# EAGLE design schody.v2 (EAGLE 9.4.0)
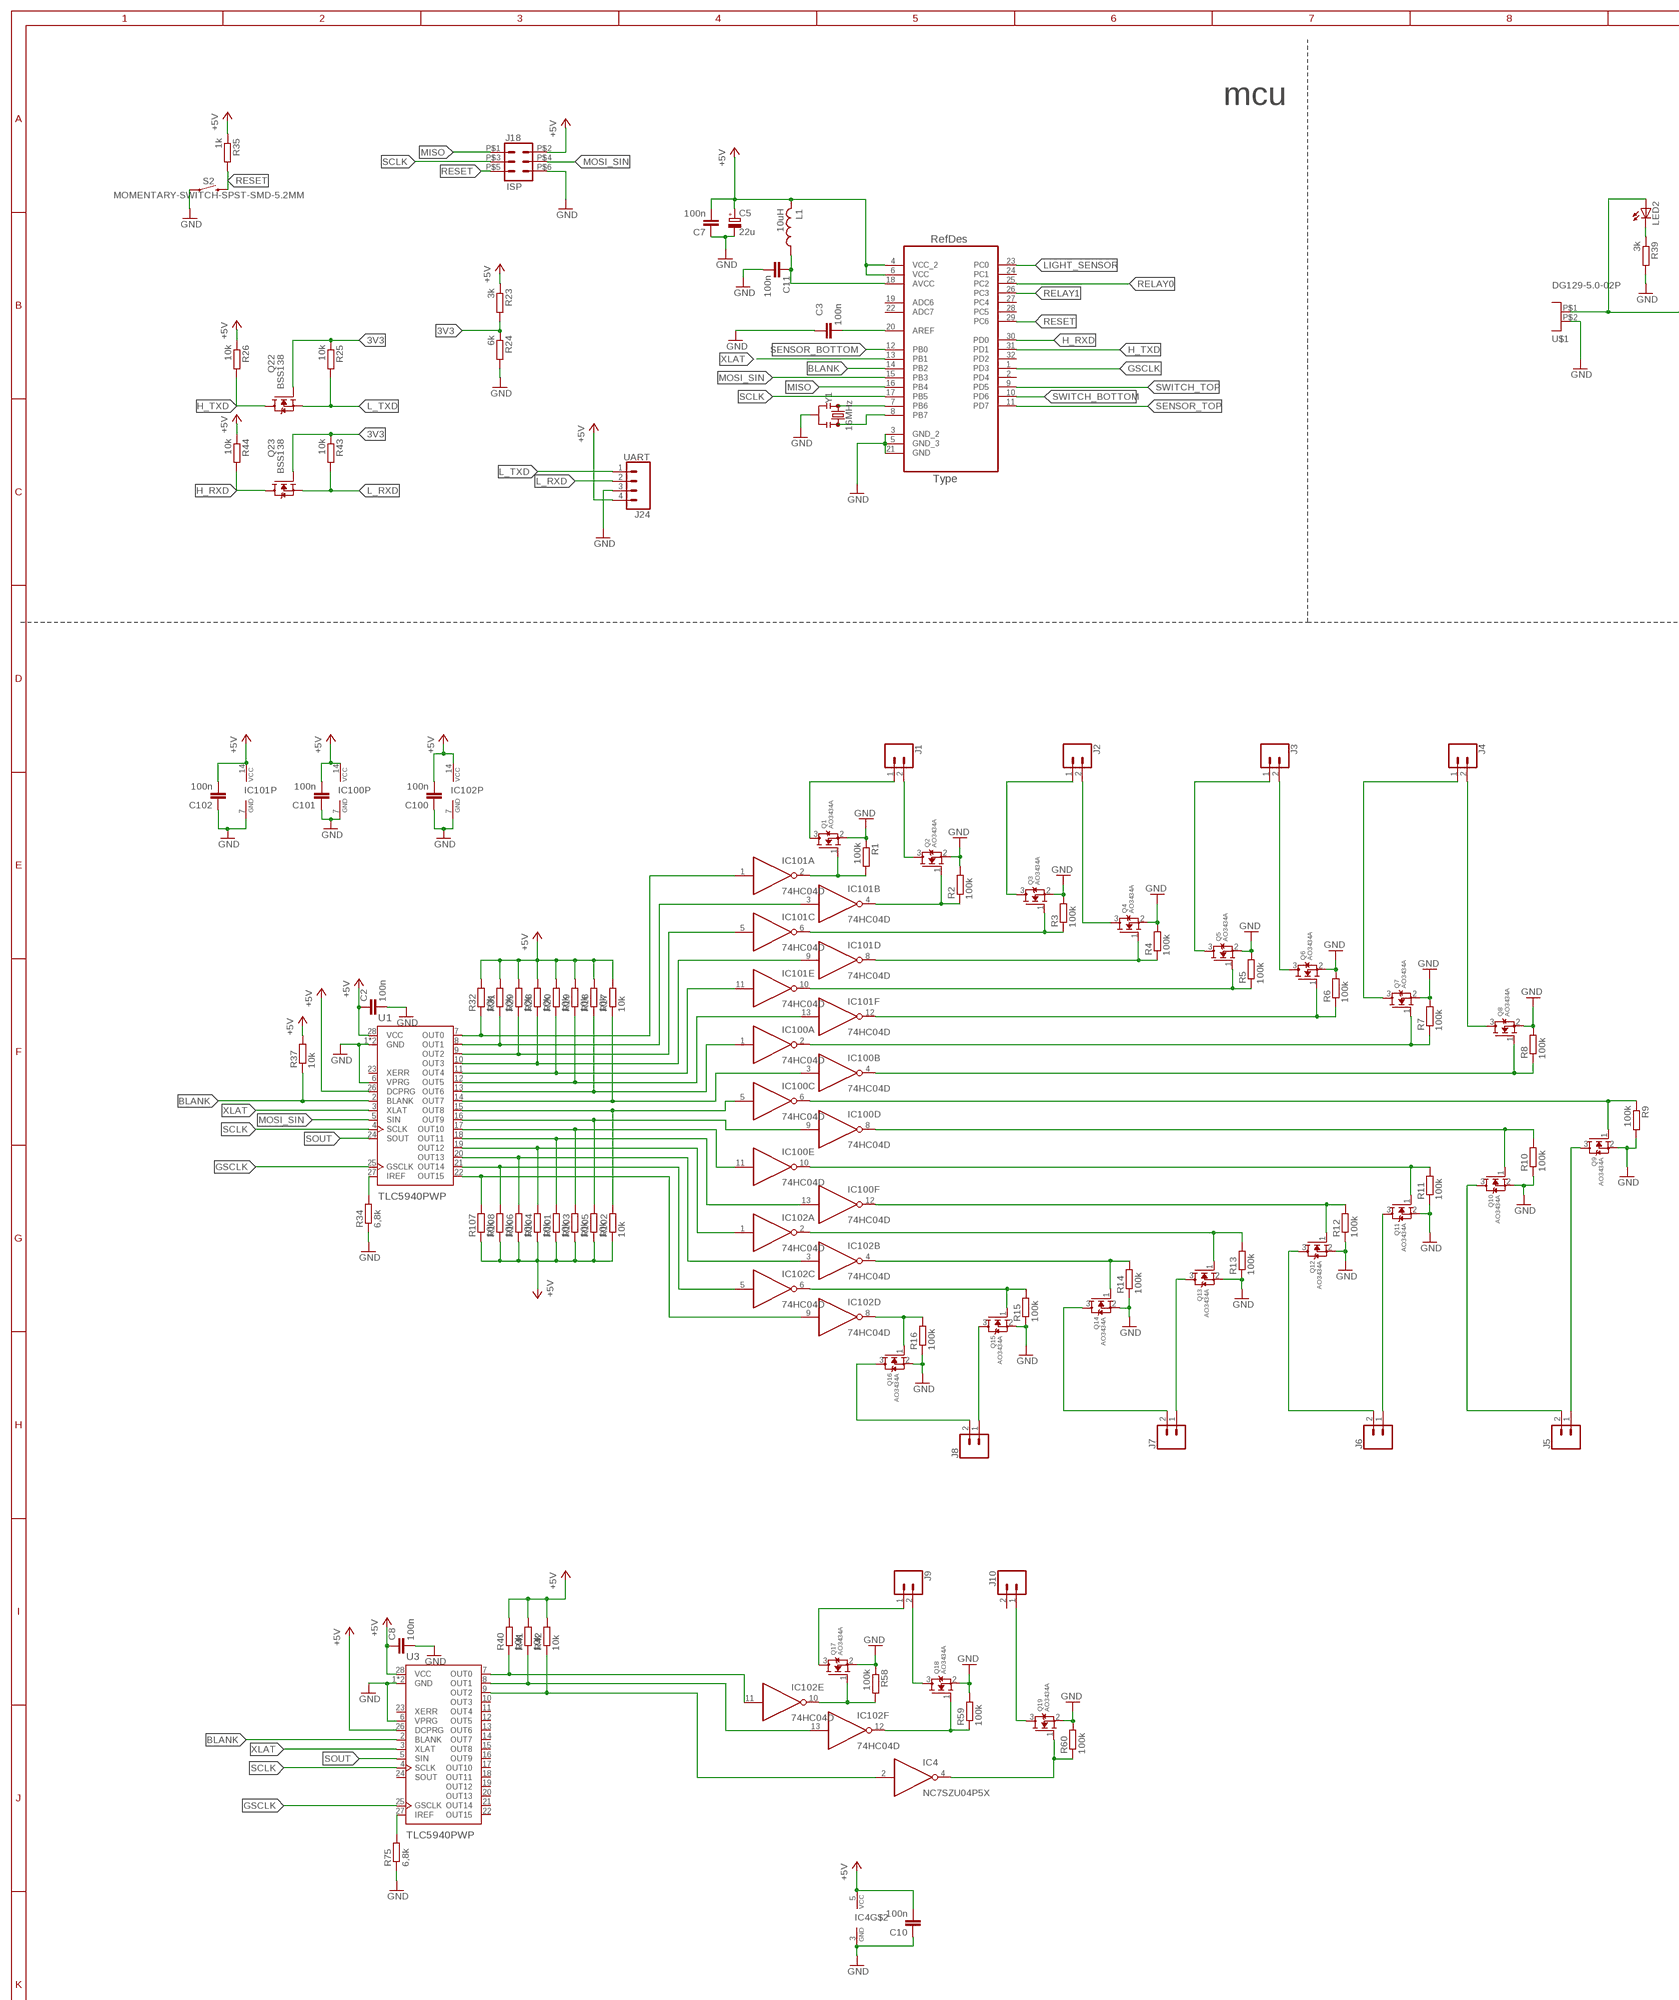
[diagram p0: schematic, sheet 1, part 1 of 3]
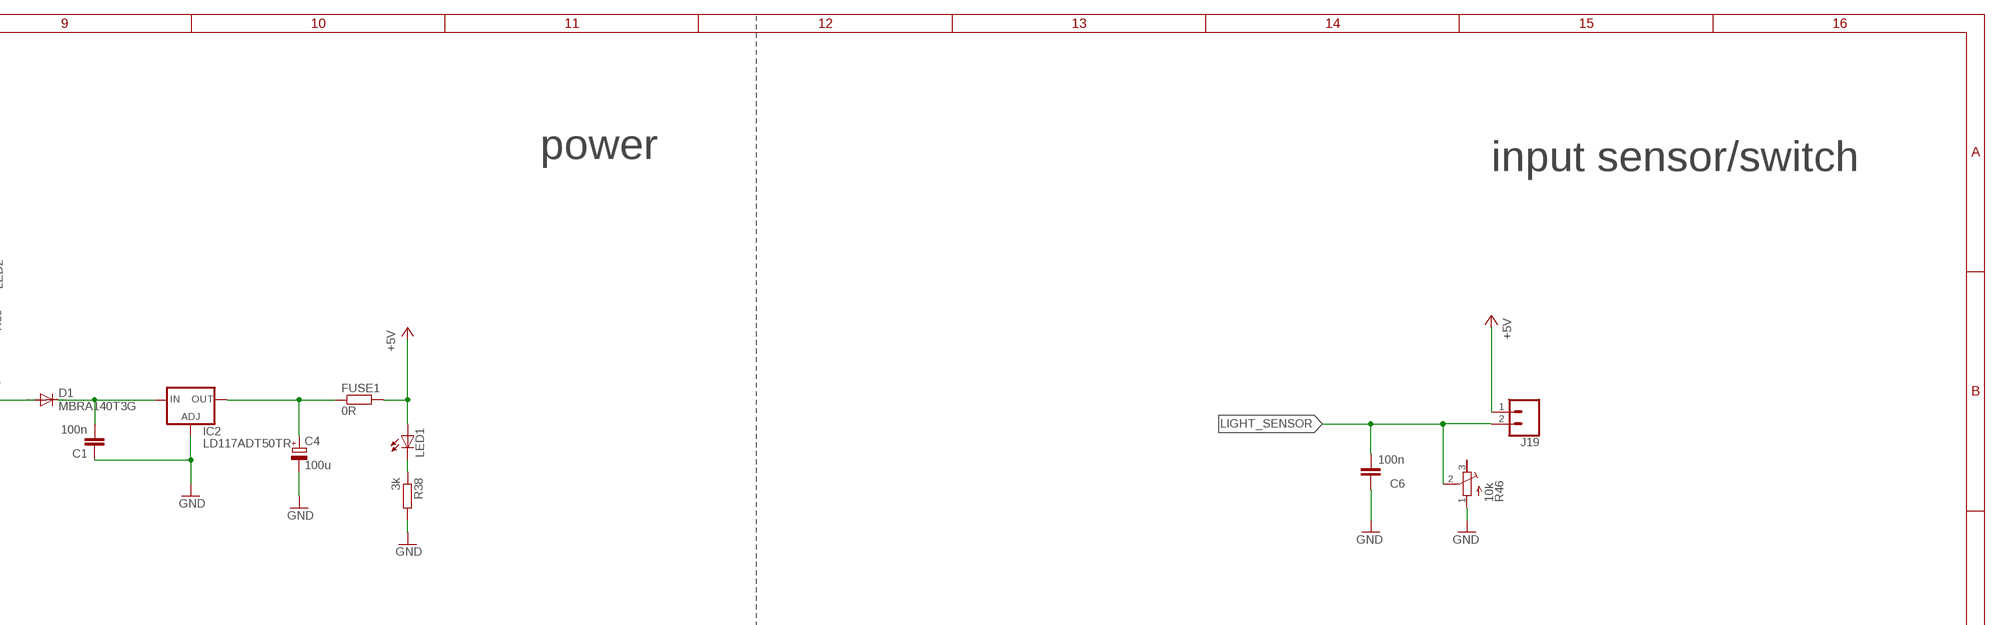
[diagram p1: schematic, sheet 1, part 2 of 3]
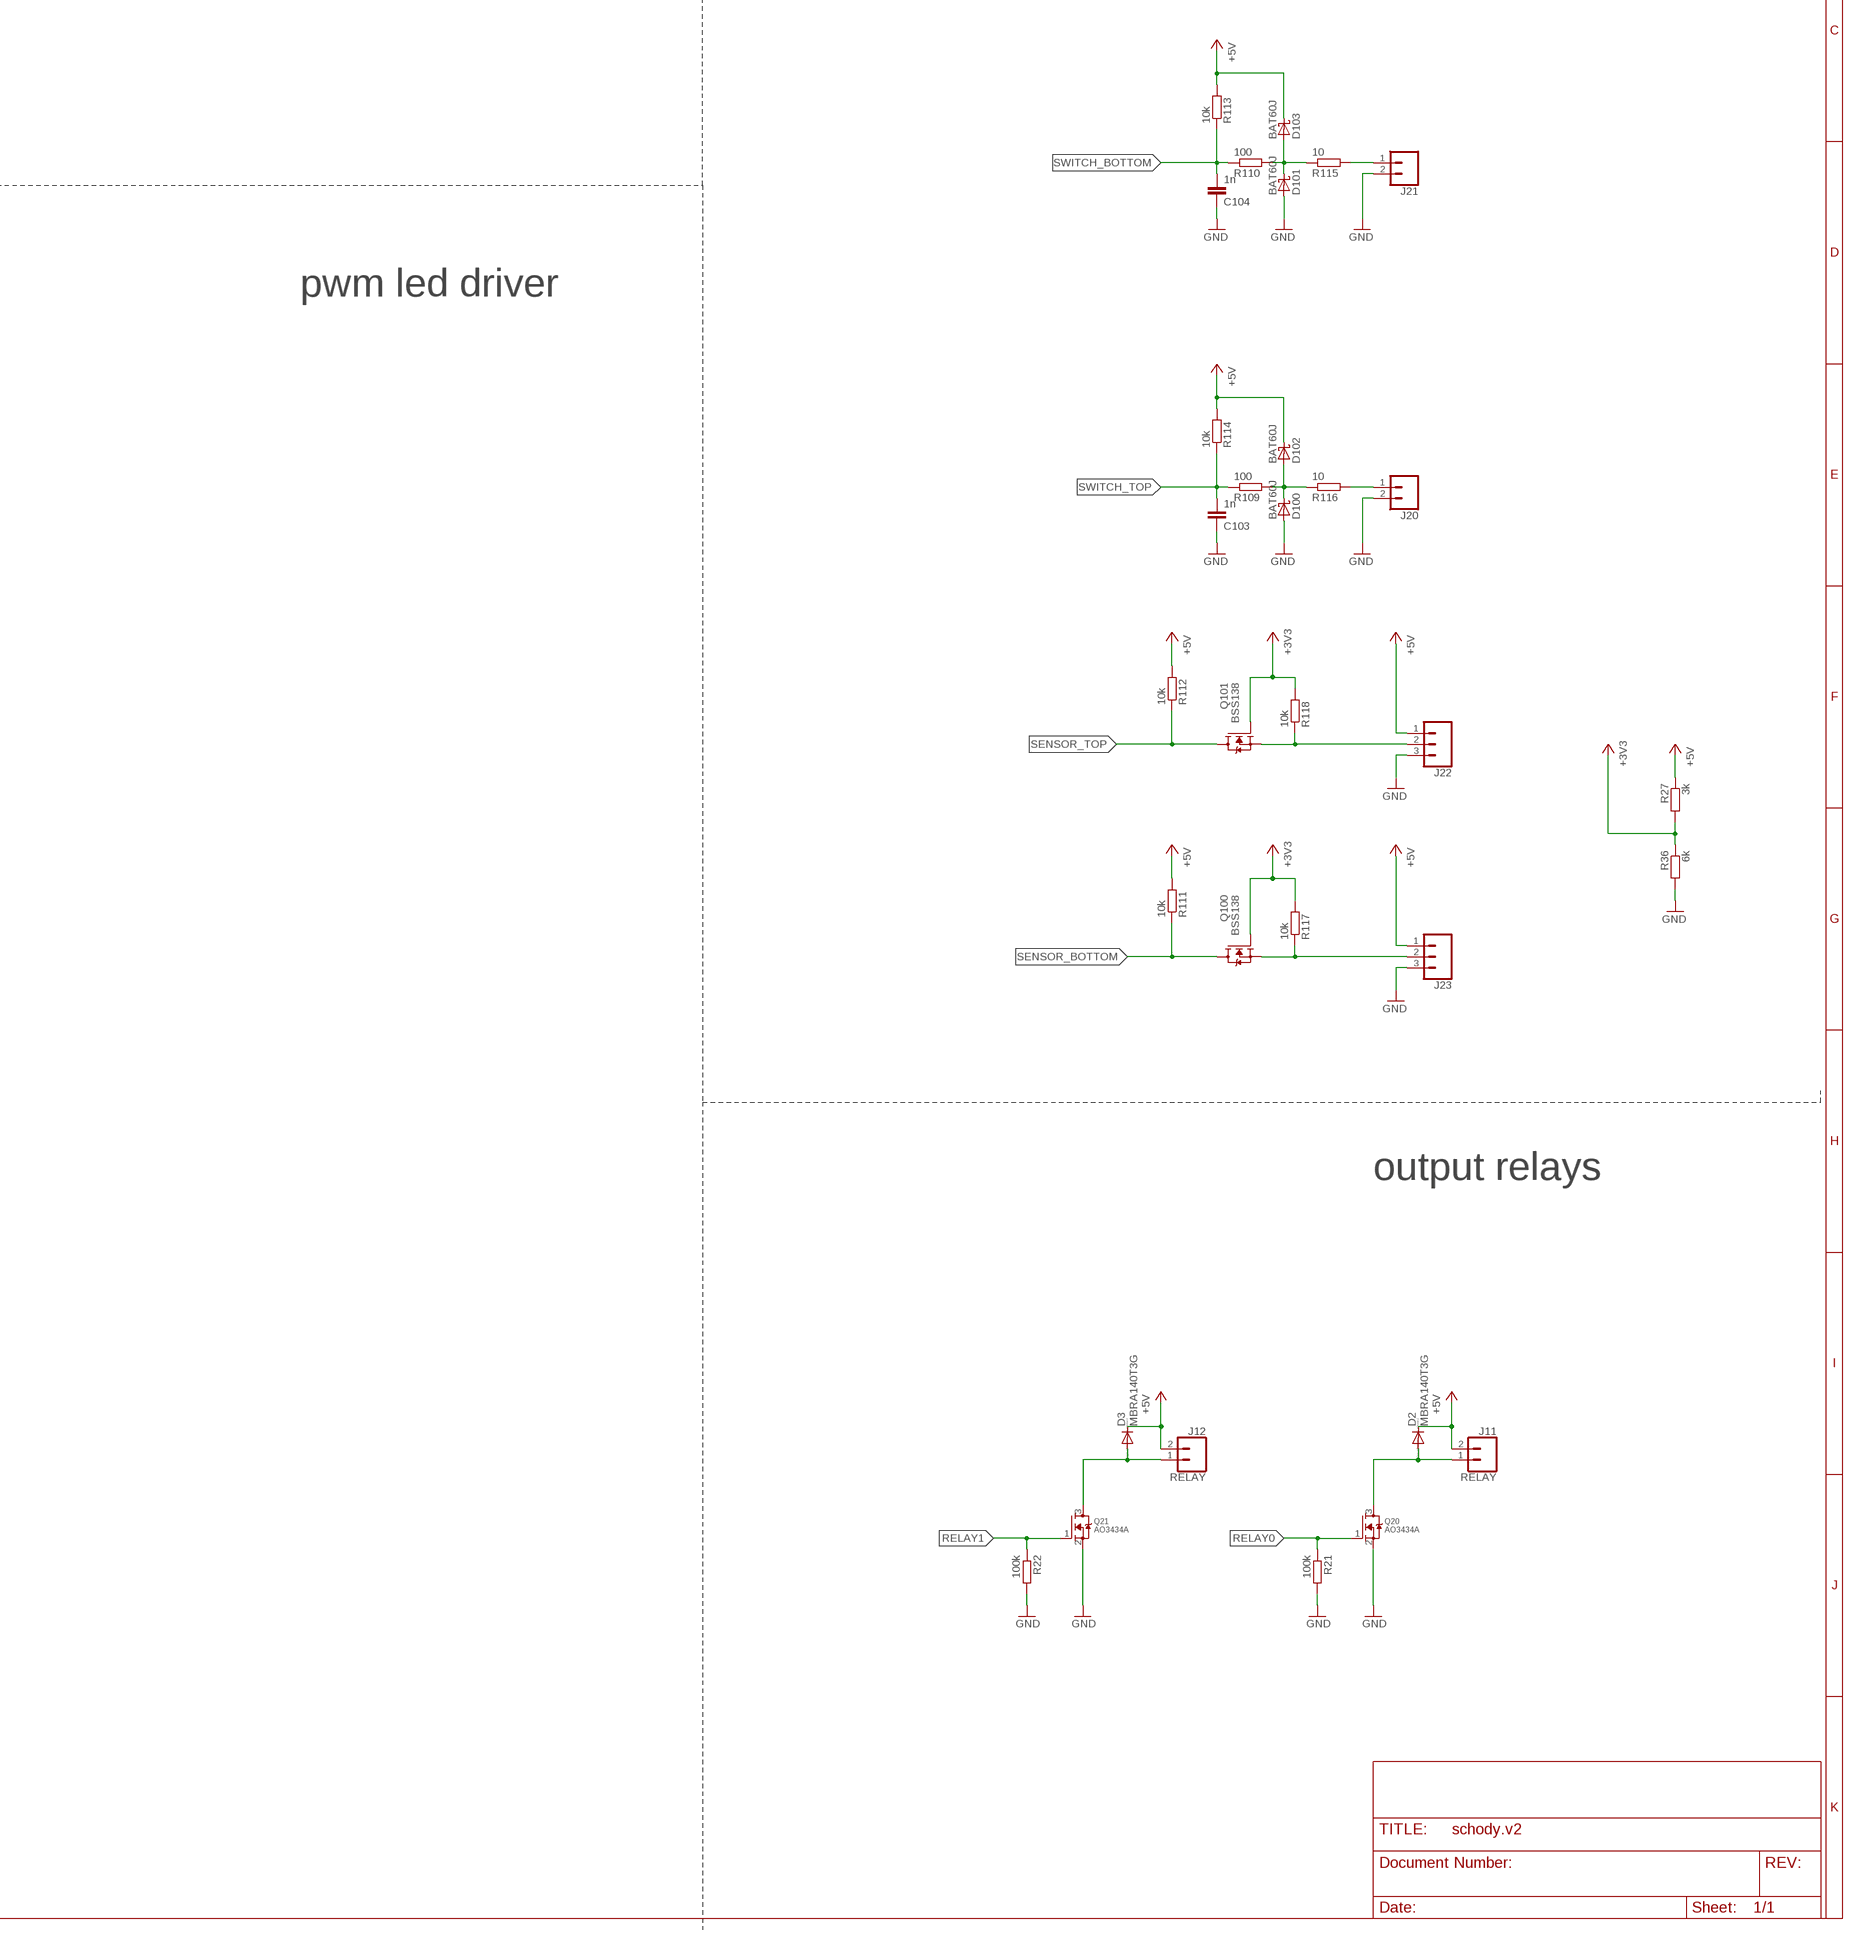
[diagram p2: schematic, sheet 1, part 3 of 3]

## Parts
C1  100n  C-EUC0805K  [C0805K]
C2  100n  C-EUC0805K  [C0805K]
C3  100n  C-EUC0805  [C0805]
C4  100u  CPOL-EUSMCD  [SMC_D]
C5  22u  CPOL-EUSMCE  [SMC_E]
C6  100n  C-EUC0805  [C0805]
C7  100n  C-EUC0805  [C0805]
C8  100n  C-EUC0805K  [C0805K]
C10  100n  C-EUC0805K  [C0805K]
C11  100n  C-EUC0805  [C0805]
C100  100n  C-EUC0805K  [C0805K]
C101  100n  C-EUC0805K  [C0805K]
C102  100n  C-EUC0805K  [C0805K]
C103  1n  C-EUC0805K  [C0805K]
C104  1n  C-EUC0805K  [C0805K]
D1  MBRA140T3G  DIODE-DO214BA  [DO214BA]
D2  MBRA140T3G  DIODE-DO214BA  [DO214BA]
D3  MBRA140T3G  DIODE-DO214BA  [DO214BA]
D100  BAT60J  [SOD323_ST]
D101  BAT60J  [SOD323_ST]
D102  BAT60J  [SOD323_ST]
D103  BAT60J  [SOD323_ST]
FUSE1  0R  R-EU_M1206  [M1206]
IC2  LD117ADT50TR  [DPACK]
IC4  NC7SZU04P5X  74AHC1GU04DCK  [SC70-5]
IC100  74HC04D  [SO14]
IC101  74HC04D  [SO14]
IC102  74HC04D  [SO14]
J1  CONN_023.5MM  [SCREWTERMINAL-3.5MM-2]
J2  CONN_023.5MM  [SCREWTERMINAL-3.5MM-2]
J3  CONN_023.5MM  [SCREWTERMINAL-3.5MM-2]
J4  CONN_023.5MM  [SCREWTERMINAL-3.5MM-2]
J5  CONN_023.5MM  [SCREWTERMINAL-3.5MM-2]
J6  CONN_023.5MM  [SCREWTERMINAL-3.5MM-2]
J7  CONN_023.5MM  [SCREWTERMINAL-3.5MM-2]
J8  CONN_023.5MM  [SCREWTERMINAL-3.5MM-2]
J9  CONN_023.5MM  [SCREWTERMINAL-3.5MM-2]
J10  CONN_023.5MM  [SCREWTERMINAL-3.5MM-2]
J11  RELAY  CONN_023.5MM  [SCREWTERMINAL-3.5MM-2]
J12  RELAY  CONN_023.5MM  [SCREWTERMINAL-3.5MM-2]
J18  ISP  CONN_03X2POGO_PINS  [2X3_POGO]
J19  CONN_023.5MM  [SCREWTERMINAL-3.5MM-2]
J20  CONN_023.5MM  [SCREWTERMINAL-3.5MM-2]
J21  CONN_023.5MM  [SCREWTERMINAL-3.5MM-2]
J22  CONN_03SCREW  [SCREWTERMINAL-3.5MM-3]
J23  CONN_03SCREW  [SCREWTERMINAL-3.5MM-3]
J24  UART  CONN_04  [1X04]
L1  10uH  L_USB  [0805]
LED1  LEDCHIP-LED0805  [CHIP-LED0805]
LED2  LEDCHIP-LED0805  [CHIP-LED0805]
Q1  AO3434A  MOSFET-NWAVE  [SOT23-W]
Q2  AO3434A  MOSFET-NWAVE  [SOT23-W]
Q3  AO3434A  MOSFET-NWAVE  [SOT23-W]
Q4  AO3434A  MOSFET-NWAVE  [SOT23-W]
Q5  AO3434A  MOSFET-NWAVE  [SOT23-W]
Q6  AO3434A  MOSFET-NWAVE  [SOT23-W]
Q7  AO3434A  MOSFET-NWAVE  [SOT23-W]
Q8  AO3434A  MOSFET-NWAVE  [SOT23-W]
Q9  AO3434A  MOSFET-NWAVE  [SOT23-W]
Q10  AO3434A  MOSFET-NWAVE  [SOT23-W]
Q11  AO3434A  MOSFET-NWAVE  [SOT23-W]
Q12  AO3434A  MOSFET-NWAVE  [SOT23-W]
Q13  AO3434A  MOSFET-NWAVE  [SOT23-W]
Q14  AO3434A  MOSFET-NWAVE  [SOT23-W]
Q15  AO3434A  MOSFET-NWAVE  [SOT23-W]
Q16  AO3434A  MOSFET-NWAVE  [SOT23-W]
Q17  AO3434A  MOSFET-NWAVE  [SOT23-W]
Q18  AO3434A  MOSFET-NWAVE  [SOT23-W]
Q19  AO3434A  MOSFET-NWAVE  [SOT23-W]
Q20  AO3434A  MOSFET-NWAVE  [SOT23-W]
Q21  AO3434A  MOSFET-NWAVE  [SOT23-W]
Q22  BSS138  [SOT23]
Q23  BSS138  [SOT23]
Q100  BSS138  [SOT23]
Q101  BSS138  [SOT23]
R1  100k  R-EU_M0805  [M0805]
R2  100k  R-EU_M0805  [M0805]
R3  100k  R-EU_M0805  [M0805]
R4  100k  R-EU_M0805  [M0805]
R5  100k  R-EU_M0805  [M0805]
R6  100k  R-EU_M0805  [M0805]
R7  100k  R-EU_M0805  [M0805]
R8  100k  R-EU_M0805  [M0805]
R9  100k  R-EU_M0805  [M0805]
R10  100k  R-EU_M0805  [M0805]
R11  100k  R-EU_M0805  [M0805]
R12  100k  R-EU_M0805  [M0805]
R13  100k  R-EU_M0805  [M0805]
R14  100k  R-EU_M0805  [M0805]
R15  100k  R-EU_M0805  [M0805]
R16  100k  R-EU_M0805  [M0805]
R17  10k  R-EU_M0805  [M0805]
R18  10k  R-EU_M0805  [M0805]
R19  10k  R-EU_M0805  [M0805]
R20  10k  R-EU_M0805  [M0805]
R21  100k  R-EU_M0805  [M0805]
R22  100k  R-EU_M0805  [M0805]
R23  3k  R-EU_M0805  [M0805]
R24  6k  R-EU_M0805  [M0805]
R25  10k  R-EU_M0805  [M0805]
R26  10k  R-EU_M0805  [M0805]
R27  3k  R-EU_M0805  [M0805]
R28  10k  R-EU_M0805  [M0805]
R29  10k  R-EU_M0805  [M0805]
R31  10k  R-EU_M0805  [M0805]
R32  10k  R-EU_M0805  [M0805]
R34  6,8k  R-EU_M0805  [M0805]
R35  1k  R-EU_M0805  [M0805]
R36  6k  R-EU_M0805  [M0805]
R37  10k  R-EU_M0805  [M0805]
R38  3k  R-EU_M0805  [M0805]
R39  3k  R-EU_M0805  [M0805]
R40  10k  R-EU_M0805  [M0805]
R41  10k  R-EU_M0805  [M0805]
R42  10k  R-EU_M0805  [M0805]
R43  10k  R-EU_M0805  [M0805]
R44  10k  R-EU_M0805  [M0805]
R46  10k  R-TRIMM64W  [RTRIM64W]
R58  100k  R-EU_M0805  [M0805]
R59  100k  R-EU_M0805  [M0805]
R60  100k  R-EU_M0805  [M0805]
R75  6,8k  R-EU_M0805  [M0805]
R101  10k  R-EU_M0805  [M0805]
R102  10k  R-EU_M0805  [M0805]
R103  10k  R-EU_M0805  [M0805]
R104  10k  R-EU_M0805  [M0805]
R105  10k  R-EU_M0805  [M0805]
R106  10k  R-EU_M0805  [M0805]
R107  10k  R-EU_M0805  [M0805]
R108  10k  R-EU_M0805  [M0805]
R109  100  R-EU_M0805  [M0805]
R110  100  R-EU_M0805  [M0805]
R111  10k  R-EU_M0805  [M0805]
R112  10k  R-EU_M0805  [M0805]
R113  10k  R-EU_M0805  [M0805]
R114  10k  R-EU_M0805  [M0805]
R115  10  R-EU_M0805  [M0805]
R116  10  R-EU_M0805  [M0805]
R117  10k  R-EU_M0805  [M0805]
R118  10k  R-EU_M0805  [M0805]
S2  MOMENTARY-SWITCH-SPST-SMD-5.2MM  [TACTILE_SWITCH_SMD_5.2MM]
U1  TLC5940PWP  [HTSSOP28PWP]
U2  ATMEGA328P-AU  [QFP80P900X900X120-32N]
U3  TLC5940PWP  [HTSSOP28PWP]
U$1  DG129-5.0-02P  [DG129-5.0-02P]
Y1  16MHz  RESONATOR-16MHZSMD_3.2X1.3  [RESONATOR-SMD-3.2X1.3]

## Nets
3V3: Q22.1(G) Q23.1(G) R23.2 R24.1 R25.1 R43.1
+3V33: Q100.1(G) Q101.1(G) R27.2 R36.1 R117.2 R118.2 ; supply symbol labelled +3V3
+5V: C2.1 C5.+ C7.2 C8.1 C10.2 C100.2 C101.2 C102.2 D2.C D3.C D102.C D103.C FUSE1.2 IC4.5(VCC) IC100.14(P:VCC) IC101.14(P:VCC) IC102.14(P:VCC) J11.2 J12.2 J18.P$2 J19.1 J22.1 J23.1 J24.4 L1.2 LED1.A R17.2 R18.2 R19.2 R20.2 R23.1 R26.1 R27.1 R28.2 R29.2 R31.2 R32.2 R35.1 R37.2 R40.2 R41.2 R42.2 R44.1 R101.1 R102.1 R103.1 R104.1 R105.1 R106.1 R107.1 R108.1 R111.2 R112.2 R113.2 R114.2 U1.26(DCPRG) U1.28(VCC) U2.4(VCC_2) U2.6(VCC) U3.26(DCPRG) U3.28(VCC)
BLANK: R37.1 U1.2(BLANK) U2.14(PB2) U3.2(BLANK)
GND: C1.1 C2.2 C3.1 C4.- C5.- C6.1 C7.1 C8.2 C10.1 C11.2 C100.1 C101.1 C102.1 C103.1 C104.1 D100.A D101.A IC2.1(ADJ) IC4.3(GND) IC100.7(P:GND) IC101.7(P:GND) IC102.7(P:GND) J18.P$6 J20.2 J21.2 J22.3 J23.3 J24.3 Q1.2(S) Q2.2(S) Q3.2(S) Q4.2(S) Q5.2(S) Q6.2(S) Q7.2(S) Q8.2(S) Q9.2(S) Q10.2(S) Q11.2(S) Q12.2(S) Q13.2(S) Q14.2(S) Q15.2(S) Q16.2(S) Q17.2(S) Q18.2(S) Q19.2(S) Q20.2(S) Q21.2(S) R1.1 R2.2 R3.2 R4.2 R5.2 R6.2 R7.2 R8.2 R9.2 R10.1 R11.1 R12.1 R13.1 R14.1 R15.1 R16.1 R21.2 R22.2 R24.2 R34.1 R36.2 R38.2 R39.2 R46.1(A) R58.1 R59.2 R60.2 R75.1 S2.1 U1.1(GND) U1.6(VPRG) U1.EXP(GND) U2.3(GND_2) U2.5(GND_3) U2.21(GND) U3.1(GND) U3.6(VPRG) U3.EXP(GND) U$1.P$2 Y1.2
GSCLK: U1.25(GSCLK) U2.1(PD3) U3.25(GSCLK)
H_RXD: Q23.3(D) R44.2 U2.30(PD0)
H_TXD: Q22.3(D) R26.2 U2.31(PD1)
L_RXD: J24.2 Q23.2(S) R43.2
L_TXD: J24.1 Q22.2(S) R25.2
LIGHT_SENSOR: C6.2 J19.2 R46.2(S) U2.23(PC0)
MISO: J18.P$1 U2.16(PB4)
MOSI_SIN: J18.P$4 U1.5(SIN) U2.15(PB3)
N$1: IC101.1(A:I) R32.1 U1.7(OUT0)
N$2: IC101.3(B:I) R31.1 U1.8(OUT1)
N$3: IC101.5(C:I) R29.1 U1.9(OUT2)
N$4: IC101.9(D:I) R28.1 U1.10(OUT3)
N$5: IC101.11(E:I) R20.1 U1.11(OUT4)
N$6: IC101.13(F:I) R19.1 U1.12(OUT5)
N$7: IC100.1(A:I) R18.1 U1.13(OUT6)
N$8: IC100.3(B:I) R17.1 U1.14(OUT7)
N$9: IC102.9(D:I) R107.2 U1.22(OUT15)
N$10: IC101.2(A:O) Q1.1(G) R1.2
N$11: IC102.3(B:I) R106.2 U1.20(OUT13)
N$12: IC102.1(A:I) R104.2 U1.19(OUT12)
N$13: IC100.13(F:I) R101.2 U1.18(OUT11)
N$14: IC100.11(E:I) R103.2 U1.17(OUT10)
N$15: IC100.9(D:I) R105.2 U1.16(OUT9)
N$16: IC100.5(C:I) R102.2 U1.15(OUT8)
N$17: IC102.5(C:I) R108.2 U1.21(OUT14)
N$18: J4.2 Q8.3(D)
N$19: IC101.6(C:O) Q3.1(G) R3.1
N$20: J2.2 Q4.3(D)
N$21: IC100.4(B:O) Q8.1(G) R8.1
N$22: J2.1 Q3.3(D)
N$23: IC101.8(D:O) Q4.1(G) R4.1
N$24: IC102.8(D:O) Q16.1(G) R16.2
N$25: J8.2 Q16.3(D)
N$26: J1.1 Q1.3(D)
N$27: IC101.10(E:O) Q5.1(G) R5.1
N$28: J3.1 Q5.3(D)
N$29: J9.2 Q18.3(D)
N$30: IC101.12(F:O) Q6.1(G) R6.1
N$31: J5.2 Q10.3(D)
N$32: J3.2 Q6.3(D)
N$33: IC102.6(C:O) Q15.1(G) R15.2
N$34: J1.2 Q2.3(D)
N$35: J6.1 Q11.3(D)
N$36: IC102.4(B:O) Q14.1(G) R14.2
N$37: J7.2 Q14.3(D)
N$38: IC100.8(D:O) Q10.1(G) R10.2
N$39: IC102.2(A:O) Q13.1(G) R13.2
N$40: IC100.6(C:O) Q9.1(G) R9.1
N$41: J7.1 Q13.3(D)
N$42: J20.1 R116.2
N$43: IC100.12(F:O) Q12.1(G) R12.2
N$44: J6.2 Q12.3(D)
N$45: J5.1 Q9.3(D)
N$46: IC100.10(E:O) Q11.1(G) R11.2
N$47: J8.1 Q15.3(D)
N$48: J21.1 R115.2
N$51: C1.2 D1.C IC2.3(IN)
N$53: U2.7(PB6) Y1.1
N$54: U2.8(PB7) Y1.3
N$55: R34.2 U1.27(IREF)
N$56: LED1.C R38.1
N$57: D101.C D103.A R110.2 R115.1
N$58: LED2.C R39.1
N$59: D100.C D102.A R109.2 R116.1
N$60: IC102.13(F:I) R41.1 U3.8(OUT1)
N$61: D2.A J11.1 Q20.3(D)
N$62: IC4.2(I) R42.1 U3.9(OUT2)
N$63: J22.2 Q101.2(S) R118.1
N$64: J23.2 Q100.2(S) R117.1
N$65: C11.1 L1.1 U2.18(AVCC)
N$66: C4.+ FUSE1.1 IC2.4(OUT)
N$67: C3.2 U2.20(AREF)
N$68: IC102.11(E:I) R40.1 U3.7(OUT0)
N$70: IC101.4(B:O) Q2.1(G) R2.1
N$71: IC100.2(A:O) Q7.1(G) R7.1
N$72: D1.A LED2.A U$1.P$1
N$73: J4.1 Q7.3(D)
N$74: D3.A J12.1 Q21.3(D)
N$75: IC4.4(O) Q19.1(G) R60.1
N$84: R75.2 U3.27(IREF)
N$85: IC102.10(E:O) Q17.1(G) R58.2
N$86: IC102.12(F:O) Q18.1(G) R59.1
N$88: J10.1 Q19.3(D)
N$116: J9.1 Q17.3(D)
RELAY0: Q20.1(G) R21.1 U2.25(PC2)
RELAY1: Q21.1(G) R22.1 U2.26(PC3)
RESET: J18.P$5 R35.2 S2.3 U2.29(PC6)
SCLK: J18.P$3 U1.4(SCLK) U2.17(PB5) U3.4(SCLK)
SENSOR_BOTTOM: Q100.3(D) R111.1 U2.12(PB0)
SENSOR_TOP: Q101.3(D) R112.1 U2.11(PD7)
SOUT: U1.24(SOUT) U3.5(SIN)
SWITCH_BOTTOM: C104.2 R110.1 R113.1 U2.10(PD6)
SWITCH_TOP: C103.2 R109.1 R114.1 U2.9(PD5)
XLAT: U1.3(XLAT) U2.13(PB1) U3.3(XLAT)
Unconnected: J10.2 R46.3(E) U1.23(XERR) U2.2(PD4) U2.19(ADC6) U2.22(ADC7) U2.24(PC1) U2.27(PC4) U2.28(PC5) U2.32(PD2) U3.10(OUT3) U3.11(OUT4) U3.12(OUT5) U3.13(OUT6) U3.14(OUT7) U3.15(OUT8) U3.16(OUT9) U3.17(OUT10) U3.18(OUT11) U3.19(OUT12) U3.20(OUT13) U3.21(OUT14) U3.22(OUT15) U3.23(XERR) U3.24(SOUT)

## Notes on the sheet
- mcu
- power | input sensor/switch
- pwm led driver
- output relays

## Library data of the parts
C1-C3 C6-C8 C10 C11 C100-C104 = rcl:C-EU: CAPACITOR, European symbol; SPICEPREFIX: C
C4 C5 = rcl:CPOL-EU: POLARIZED CAPACITOR, European symbol; SPICEPREFIX: C
D1-D3 = diode:DIODE-: DIODE
D100 D102 = diode:BAT60J: Schottky barrier diode Source: www.st.com, BAT60J.pdf; SPICEPREFIX: D
D101 D103 = diode:BAT60J: Schottky barrier diode Source: www.st.com, BAT60J.pdf
FUSE1 R21-R27 R35 R36 R38 R39 R43 R44 = rcl:R-EU_: RESISTOR, European symbol; SPICEPREFIX: R
IC2 = v-reg:LD117A?*: Low drop fixed and adjustable positive voltage regulators 1 A Source: http://www.st.com/stonline/products/literature/ds/7194/ld1117axx.pdf
IC4 = 74xx-little-us:74*1GU04: Single Unbuffered Inverter
IC100-IC102 = 74xx-eu:74*04: Hex INVERTER
J1-J12 J19-J21 = SparkFun-Connectors:CONN_02: Multi connection point. Often used as Generic Header-pin footprint for 0.1 inch spaced/style header connections On any of the 0.1 inch spaced packages, you can populate with these: Break Away Headers - Straight <https://www.sparkfun.com/products/116> (PRT-00116) Break Away Male Headers - Right Angle <https://www.sparkfun.com/products/553> (PRT-00553) Female Headers <https://www.sparkfun.com/products/115> (PRT-00115) Break Away Headers - Machine Pin <https://www.sparkfun.com/products/117> (PRT-00117) Break Away Female Headers - Swiss Machine Pin <https://www.sparkfun.com/products/743> (PRT-00743) For SCREWTERMINALS and SPRING TERMINALS visit here: Screw Terimnals on SparkFun.com <https://www.sparkfun.com/search/results?term=Screw+Terminals> (5mm/3.5mm/2.54mm spacing) This device is also useful as a general connection point to wire up your design to another part of your project. Our various solder wires solder well into these plated through hole pads. Hook-Up Wire - Assortment (Stranded, 22 AWG) <https://www.sparkfun.com/products/11375> (PRT-11375) Hook-Up Wire - Assortment (Solid Core, 22 AWG) <https://www.sparkfun.com/products/11367> (PRT-11367) View the entire wire category on our website here <https://www.sparkfun.com/categories/141> Special notes: Molex polarized connector foot print use with: PRT-08233 with associated crimp pins and housings. 2.54_SCREWTERM for use with PRT-10571. 3.5mm Screw Terminal footprints for PRT-08084 5mm Screw Terminal footprints for use with PRT-08432; PROD_ID: CONN-08399
J18 = SparkFun-Connectors:CONN_03X2: Multi connection point. Often used as Generic Header-pin footprint for 0.1 inch spaced/style header connections You can populate with any combo of single row headers, but if you'd like an exact match, check these: Header - 2x3 (Male, 0.1") <https://www.sparkfun.com/products/12807> (PRT-12807) Header - 2x3 (Female, 0.1") <https://www.sparkfun.com/products/13010> (PRT-13010) 2x3 Pin Shrouded Header <https://www.sparkfun.com/products/10877> (PRT-10877) On any of the 0.1 inch spaced packages, you can populate with these: Break Away Headers - Straight <https://www.sparkfun.com/products/116> (PRT-00116) Break Away Male Headers - Right Angle <https://www.sparkfun.com/products/553> (PRT-00553) Female Headers <https://www.sparkfun.com/products/115> (PRT-00115) Break Away Headers - Machine Pin <https://www.sparkfun.com/products/117> (PRT-00117) Break Away Female Headers - Swiss Machine Pin <https://www.sparkfun.com/products/743> (PRT-00743) Special note: the shrouded connector mates well with our 3x2 ribbon cables: Ribbon Crimp Connector - 6-pin (2x3, Female) <https://www.sparkfun.com/products/10651> (PRT-10651) Ribbon Cable - 6 wire (15ft) <https://www.sparkfun.com/products/10646> (PRT-10646); PROD_ID: HW-11044
J22 J23 = SparkFun-Connectors:CONN_03: Multi connection point. Often used as Generic Header-pin footprint for 0.1 inch spaced/style header connections On any of the 0.1 inch spaced packages, you can populate with these: Break Away Headers - Straight <https://www.sparkfun.com/products/116> (PRT-00116) Break Away Male Headers - Right Angle <https://www.sparkfun.com/products/553> (PRT-00553) Female Headers <https://www.sparkfun.com/products/115> (PRT-00115) Break Away Headers - Machine Pin <https://www.sparkfun.com/products/117> (PRT-00117) Break Away Female Headers - Swiss Machine Pin <https://www.sparkfun.com/products/743> (PRT-00743) Stackable Header - 3 Pin (Female, 0.1") <https://www.sparkfun.com/products/13875> (PRT-13875) For SCREWTERMINALS and SPRING TERMINALS visit here: Screw Terimnals on SparkFun.com <https://www.sparkfun.com/search/results?term=Screw+Terminals> (5mm/3.5mm/2.54mm spacing) This device is also useful as a general connection point to wire up your design to another part of your project. Our various solder wires solder well into these plated through hole pads. Hook-Up Wire - Assortment (Stranded, 22 AWG) <https://www.sparkfun.com/products/11375> (PRT-11375) Hook-Up Wire - Assortment (Solid Core, 22 AWG) <https://www.sparkfun.com/products/11367> (PRT-11367) View the entire wire category on our website here <https://www.sparkfun.com/categories/141> Special notes: Molex polarized connector foot print use with SKU : PRT-08232 with associated crimp pins and housings.; PROD_ID: CONN-08288; SF_ID: PRT-08235
J24 = SparkFun-Connectors:CONN_04: Multi connection point. Often used as Generic Header-pin footprint for 0.1 inch spaced/style header connections On any of the 0.1 inch spaced packages, you can populate with these: Break Away Headers - Straight <https://www.sparkfun.com/products/116> (PRT-00116) Break Away Male Headers - Right Angle <https://www.sparkfun.com/products/553> (PRT-00553) Female Headers <https://www.sparkfun.com/products/115> (PRT-00115) Break Away Headers - Machine Pin <https://www.sparkfun.com/products/117> (PRT-00117) Break Away Female Headers - Swiss Machine Pin <https://www.sparkfun.com/products/743> (PRT-00743) For SCREWTERMINALS and SPRING TERMINALS visit here: Screw Terimnals on SparkFun.com <https://www.sparkfun.com/search/results?term=Screw+Terminals> (5mm/3.5mm/2.54mm spacing) This device is also useful as a general connection point to wire up your design to another part of your project. Our various solder wires solder well into these plated through hole pads. Hook-Up Wire - Assortment (Stranded, 22 AWG) <https://www.sparkfun.com/products/11375> (PRT-11375) Hook-Up Wire - Assortment (Solid Core, 22 AWG) <https://www.sparkfun.com/products/11367> (PRT-11367) View the entire wire category on our website here <https://www.sparkfun.com/categories/141> Special notes: Molex polarized connector foot print use with SKU : PRT-08231 with associated crimp pins and housings. 1MM SMD Version SKU: PRT-10208; PROD_ID: CONN-09696
L1 = m-pad-2.1:L_US: Inductors in various packages from: - Sumida - Panasonic - Coilcraft
LED1 LED2 = adafruit:LED: LED OSRAM: - CHIPLED LG R971, LG N971, LY N971, LG Q971, LY Q971, LO R971, LY R971 LH N974, LH R974 LS Q976, LO Q976, LY Q976 LO Q996 - Hyper CHIPLED LW Q18S LB Q993, LB Q99A, LB R99A - SideLED LS A670, LO A670, LY A670, LG A670, LP A670 LB A673, LV A673, LT A673, LW A673 LH A674 LY A675 LS A676, LA A676, LO A676, LY A676, LW A676 LS A679, LY A679, LG A679 - Hyper Micro SIDELED® LS Y876, LA Y876, LO Y876, LY Y876 LT Y87S - SmartLED LW L88C, LW L88S LB L89C, LB L89S, LG L890 LS L89K, LO L89K, LY L89K LS L896, LA L896, LO L896, LY L896 - TOPLED LS T670, LO T670, LY T670, LG T670, LP T670 LSG T670, LSP T670, LSY T670, LOP T670, LYG T670 LG T671, LOG T671, LSG T671 LB T673, LV T673, LT T673, LW T673 LH T674 LS T676, LA T676, LO T676, LY T676, LB T676, LH T676, LSB T676, LW T676 LB T67C, LV T67C, LT T67C, LS T67K, LO T67K, LY T67K, LW E67C LS E67B, LA E67B, LO E67B, LY E67B, LB E67C, LV E67C, LT E67C LW T67C LS T679, LY T679, LG T679 LS T770, LO T770, LY T770, LG T770, LP T770 LB T773, LV T773, LT T773, LW T773 LH T774 LS E675, LA E675, LY E675, LS T675 LS T776, LA T776, LO T776, LY T776, LB T776 LHGB T686 LT T68C, LB T68C - Hyper Mini TOPLED® LB M676 - Mini TOPLED Santana® LG M470 LS M47K, LO M47K, LY M47K Source: http://www.osram.convergy.de/
Q1-Q21 = adafruit:MOSFET-N: N-Channel Mosfet 2N7002E - 60V 260mA SOT23 [Digikey: 2N7002ET1GOSTR-ND] - REEL BSH103 - 30V 850mA SOT23 [Digikey: 568-5013-1-ND]
Q22 Q23 Q100 Q101 = bss138_10:BSS138: BSS138 N-Channel Logic Level Enhancement Mode Field Effect Transistor Source: http://www.fairchildsemi.com/datasheets/BS/BSS138.pdf; MF: Fairchild; MPN: BSS138; OC_FARNELL: 9845330; OC_NEWARK: 67R2009
R1-R20 R28 R29 R31 R32 R34 R37 R40-R42 R58-R60 R75 R101-R108 R110-R113 R115 R117 R118 = resistor:R-EU_: RESISTOR, European symbol
R46 = resistor:R-TRIMM: Trimm resistor
R109 R114 R116 = resistor:R-EU_: RESISTOR, European symbol; SPICEPREFIX: R
S2 = SparkFun-Switches:MOMENTARY-SWITCH-SPST: Momentary Switch (Pushbutton) - SPST Normally-open (NO) SPST momentary switches (buttons, pushbuttons). Variants PTH-12MM - 12mm square, through-hole Momentary Pushbutton Switch - 12mm Square <https://www.sparkfun.com/products/9190> (COM-09190) PTH-6.0MM, PTH-6.0MM-KIT - 6.0mm square, through-hole Mini Pushbutton Switch <https://www.sparkfun.com/products/97> (COM-00097) KIT package intended for soldering kit's - only one side of pads' copper is exposed. PTH-RIGHT-ANGLE-KIT - Right-angle, through-hole Right Angle Tactile Button <https://www.sparkfun.com/products/10791> - Used on SparkFun BigTime Watch Kit <https://www.sparkfun.com/products/11734> SMD-12MM - 12mm square, surface-mount Tactile Button - SMD (12mm) <https://www.sparkfun.com/products/12993> (COM-12993) Used on SparkFun PicoBoard <https://www.sparkfun.com/products/11888> SMD-4.5MM - 4.5mm Square Trackball Switch Used on SparkFun Blackberry Trackballer Breakout <https://www.sparkfun.com/products/13169> SMD-4.6MMX2.8MM - 4.60mm x 2.80mm, surface mount Used on SparkFun SAMD21 Mini Breakout <https://www.sparkfun.com/products/13664> SMD-5.2MM, SMD-5.2-REDUNDANT - 5.2mm square, surface-mount Mini Pushbutton Switch - SMD <https://www.sparkfun.com/products/8720> (COM-08720) Used on Arduino Pro Mini <https://www.sparkfun.com/products/11114> REDUNDANT package connects both switch circuits together SMD-6.0X3.5MM - 6.0 x 3.5mm, surface mount Momentary Reset Switch SMD <https://www.sparkfun.com/products/8229> (COM-08229) SMD-6.2MM-TALL - 6.2mm square, surface mount Tactile Button - SMD (6mm) <https://www.sparkfun.com/products/12992> Used on SparkFun Digital Sandbox <https://www.sparkfun.com/products/12651> SMD-RIGHT-ANGLE - Right-angle, surface mount Used on SparkFun Block for Intel® Edison - Arduino <https://www.sparkfun.com/products/13036>; PROD_ID: SWCH-08247; SF_SKU: COM-08720
U1 U3 = tlc5940a:TLC5940
U2 = Atmel-ATMEGA328P-AU:ATMEGA328P-AU; DESCRIPTION: 8-bit Microcontroller with In-System Programmable Flash; MPN: ATMEGA328P-AU; OC_FARNELL: 1715486; OC_NEWARK: 14R4631; PACKAGE: TQFP-32; SUPPLIER: Atmel
U$1 = con-dg55:DG129-5.0-02P
Y1 = SparkFun-Clocks:RESONATOR-16MHZ: 16MHz Resonator Digikey Example <http://www.digikey.com/product-detail/en/murata-electronics-north-america/CSTCE16M0V53-R0/490-1198-1-ND/584635> Frequency: 16MHz Frequency Stability: ±0.3% Frequency Tolerance: ±0.5% Capacitance: 15pF SparkFun Products SparkFun OpenLog <https://www.sparkfun.com/products/13712> SparkFun MicroView - OLED Arduino Module <https://www.sparkfun.com/products/12923>; PROD_ID: XTAL-08900

## Net classes
0 default: clearance 0.205 mm

## Board
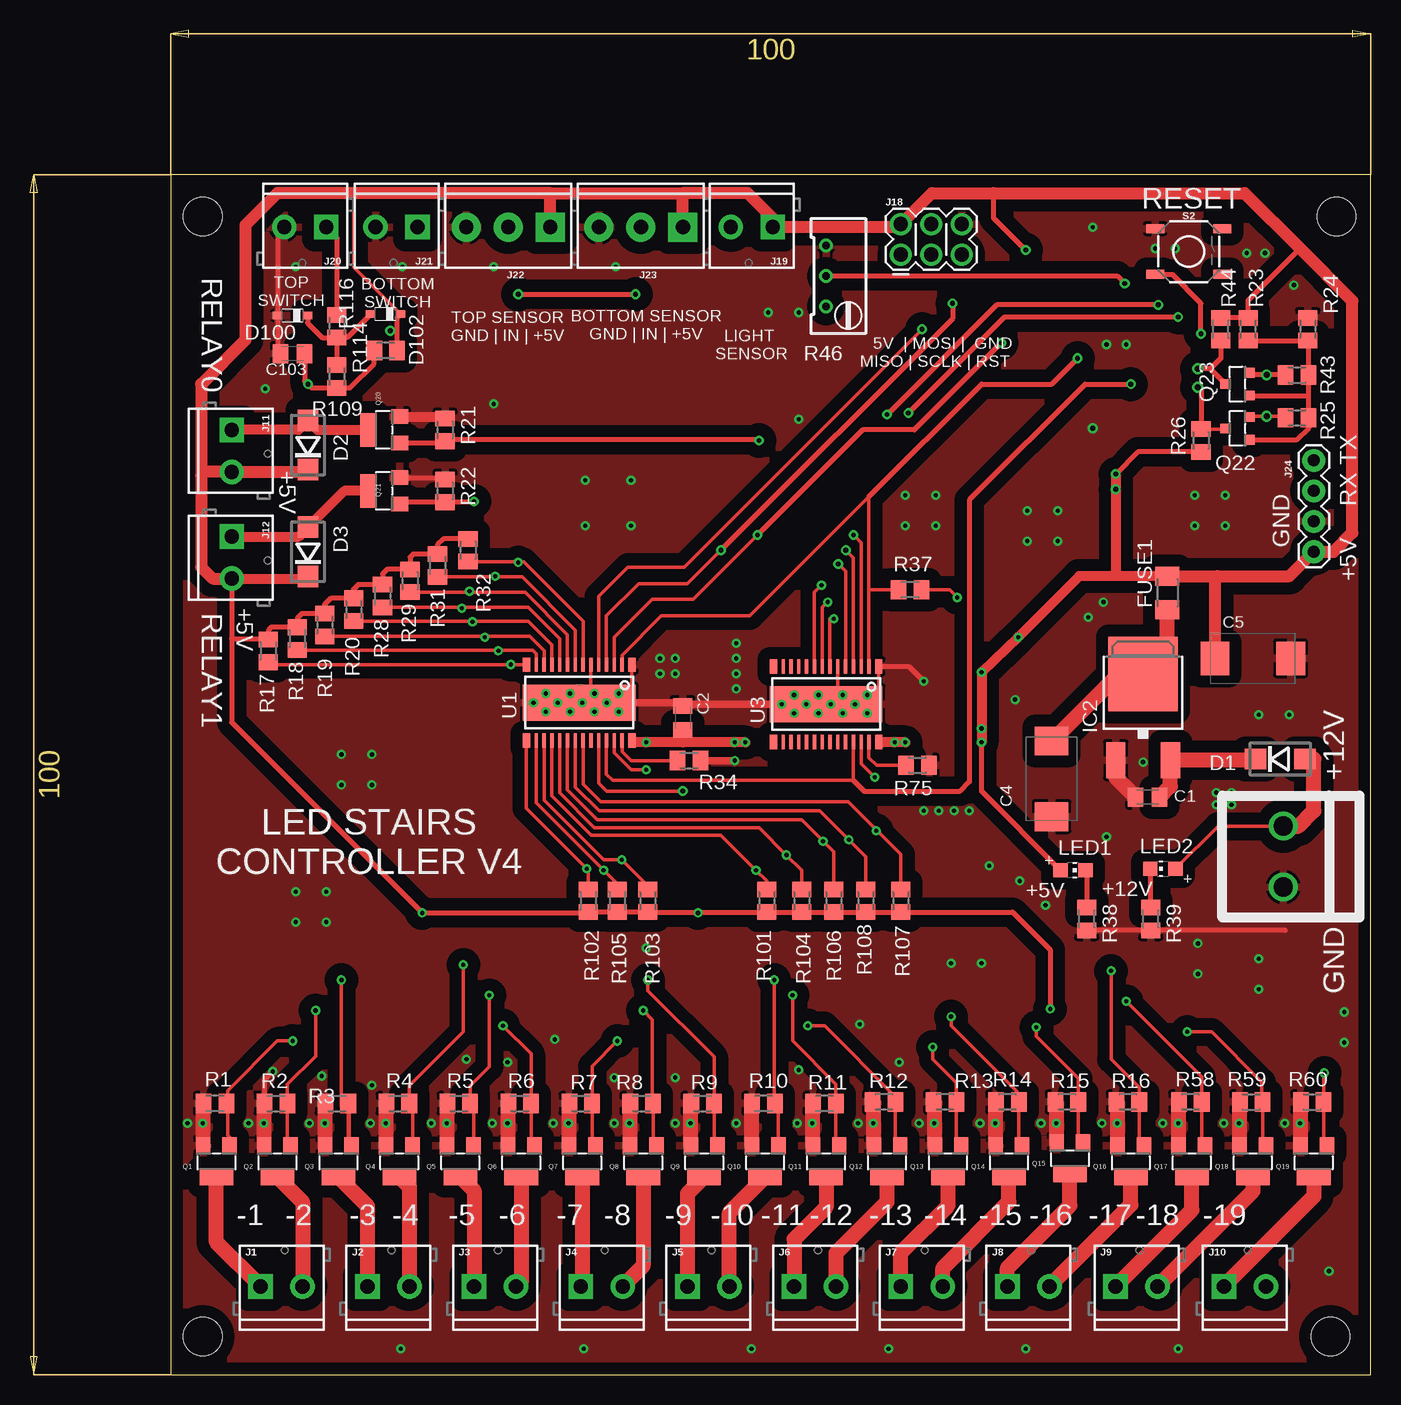
[diagram p3: board, top side]
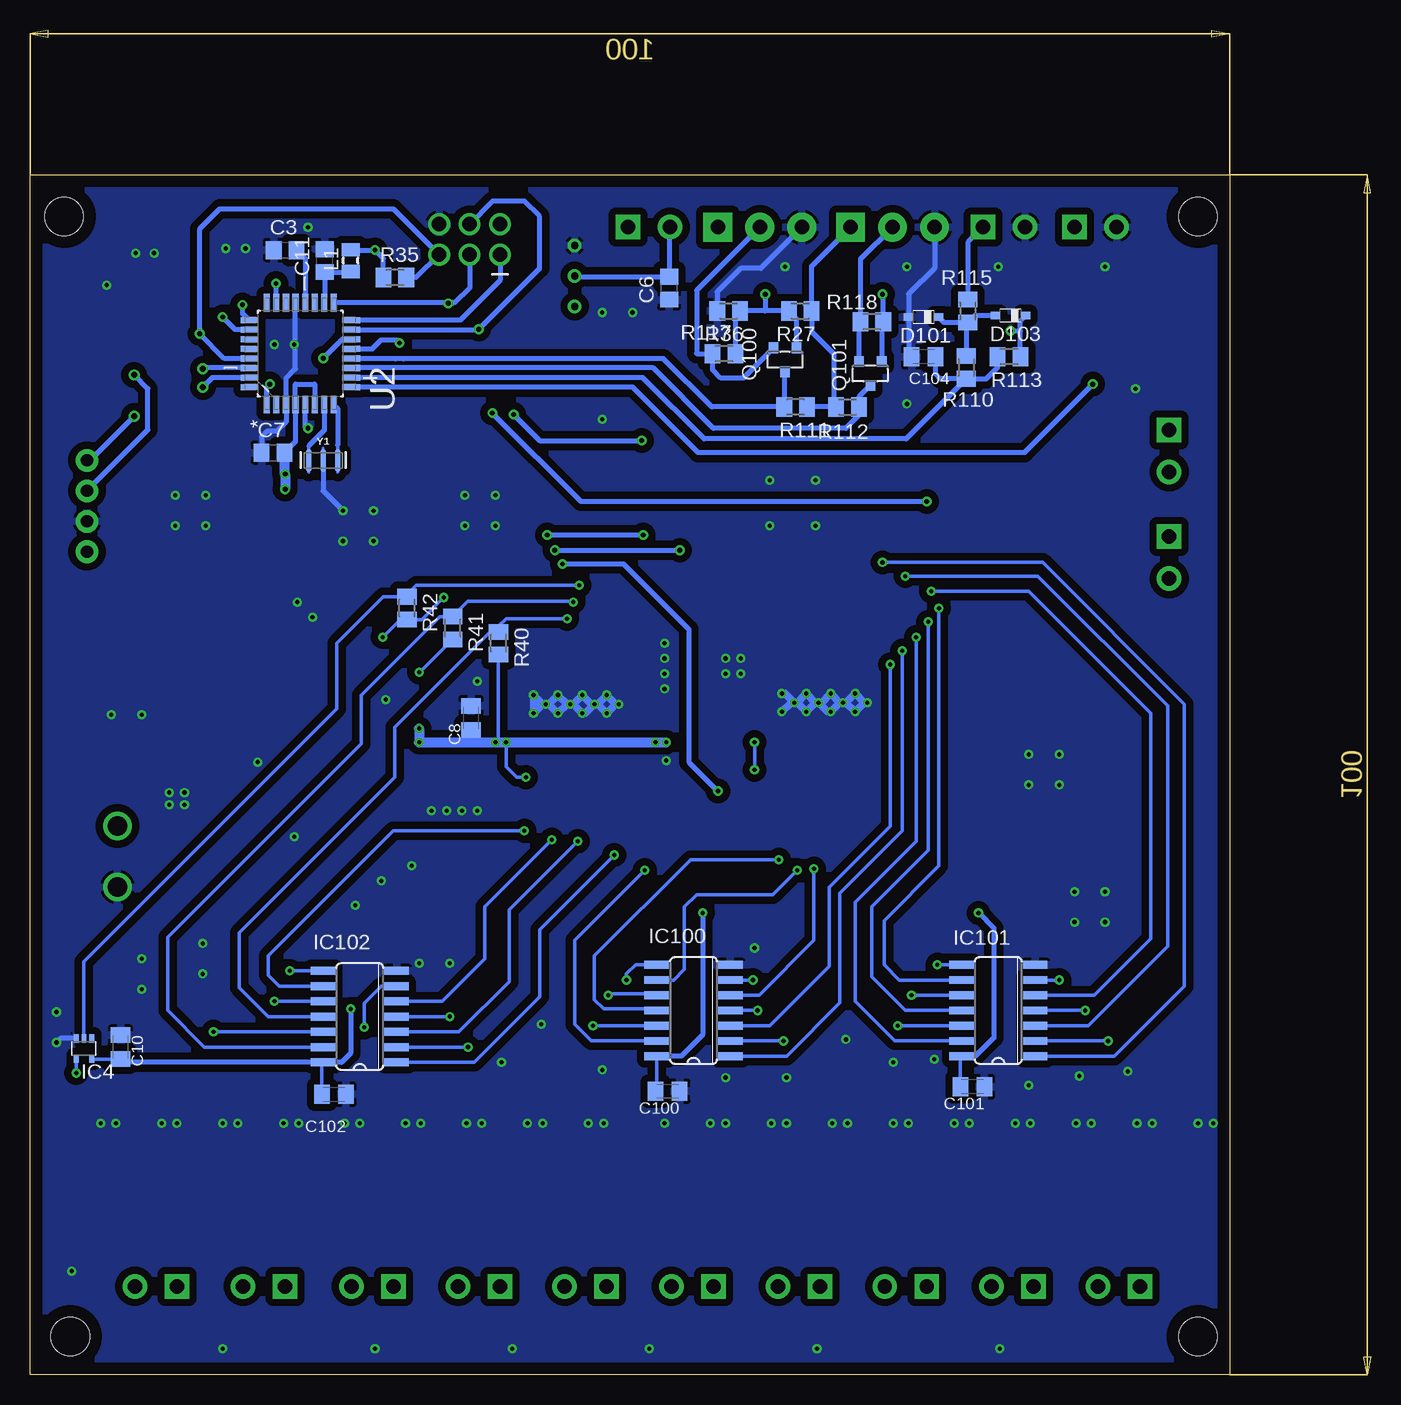
[diagram p4: board, bottom side, seen from below]

Size 100 x 100 mm. Coordinates in mm from the lower left corner, seen from the top.
Outline: 0,0 100,0 100,100 0,100 0,0
Copper layers (1*16): Top 0.035mm / dielectric 1.5mm / Bottom 0.035mm
Design rules "default *": minimum track width 10mil, minimum drill 0.35mm, track to track 6mil, track to pad 6mil, pad to pad 6mil, via to via 6mil, smd to smd 16mil, copper to edge 40mil, drill to drill 6mil, minimum pad ring 10mil, minimum via ring 8mil, stop-mask expansion 4mil, vias tented up to drill 0mil, thermal gap 10mil
Holes 3.2 mm at 2.67,3.17 2.67,96.52 96.65,3.17 97.16,96.52

### Footprints (pad centres in the part's own frame; a part is rotated, then mirrored left to right if it is on the bottom)
C0805K = smd 1.3 x 1.6: 1 -1,0; 2 1,0
C0805 = smd 1.3 x 1.5: 1 -0.95,0; 2 0.95,0
SMC_D = smd 2.4 x 2.8: + -3.15,0; - 3.15,0
SMC_E = smd 2.4 x 2.8: + -3.15,0; - 3.15,0
DO214BA = smd 1.8 x 1.7: A 2.05,0; C -2.05,0
SOD323_ST = smd 0.8 x 0.6: A 1.25,0; C -1.25,0
M1206 = smd 1.6 x 2: 1 -1.4,0; 2 1.4,0
DPACK = smd 1.6 x 3: 1 -2.28,-4.8; 3 2.28,-4.8 | smd 5.8 x 6.2: 4 0,2.38
SC70-5 = smd 0.4 x 0.7: 1 -0.65,-0.85; 2 0,-0.85; 3 0.65,-0.85; 4 0.65,0.85; 5 -0.65,0.85
SO14 = smd 0.66 x 2.032: 1 -3.81,-3.073; 2 -2.54,-3.073; 3 -1.27,-3.073; 4 0,-3.073; 5 1.27,-3.073; 6 2.54,-3.073; 7 3.81,-3.073; 8 3.81,3.073; 9 2.54,3.073; 10 1.27,3.073; 11 0,3.073; 12 -1.27,3.073; 13 -2.54,3.073; 14 -3.81,3.073
SCREWTERMINAL-3.5MM-2 = drill 1.2 pad 2.032 square: 1 0,0 | drill 1.2 pad 2.032: 2 3.5,0
2X3_POGO = drill 1.2 pad 1.829: P$1 0,0; P$2 0,2.54; P$3 2.54,0; P$4 2.54,2.54; P$5 5.08,0; P$6 5.08,2.54
SCREWTERMINAL-3.5MM-3 = drill 1.2 pad 2.413 square: 1 0,0 | drill 1.2 pad 2.413: 2 3.5,0; 3 7,0
1X04 = drill 1.016 pad 1.88: 1 0,0; 2 2.54,0; 3 5.08,0; 4 7.62,0
0805 = smd 1.1 x 1.5: 1 -0.9,0; 2 0.9,0
CHIP-LED0805 = smd 1.2 x 1.2: A 0,-1.05; C 0,1.05
SOT23-W = smd 1.2 x 1.4: 1 -1.1,-1.3; 2 1.1,-1.3 | smd 2.8 x 1.4: 3 0,1.3
SOT23 = smd 0.8 x 0.9: 1 -0.95,-1; 2 0.95,-1; 3 0,1
M0805 = smd 1.3 x 1.6: 1 -0.95,0; 2 0.95,0
RTRIM64W = drill 0.61: 1 1.27,-2.54; 2 1.27,0; 3 1.27,2.54
TACTILE_SWITCH_SMD_5.2MM = smd 1.524 x 0.762: 1 -2.794,1.905; 2 2.794,1.905; 3 -2.794,-1.905; 4 2.794,-1.905
HTSSOP28PWP = smd 0.61 x 1.2: 1 -4.395,-3.154; 14 4.395,-3.154; 15 4.395,3.154; 28 -4.395,3.154 | smd 0.27 x 1.2: 2 -3.575,-3.154; 3 -2.925,-3.154; 4 -2.275,-3.154; 5 -1.625,-3.154; 6 -0.975,-3.154; 7 -0.325,-3.154; 8 0.325,-3.154; 9 0.975,-3.154; 10 1.625,-3.154; 11 2.275,-3.154; 12 2.925,-3.154; 13 3.575,-3.154; 16 3.575,3.154; 17 2.925,3.154; 18 2.275,3.154; 19 1.625,3.154; 20 0.975,3.154; 21 0.325,3.154; 22 -0.325,3.154; 23 -0.975,3.154; 24 -1.625,3.154; 25 -2.275,3.154; 26 -2.925,3.154; 27 -3.575,3.154 | smd 9.4 x 3: EXP 0,0
QFP80P900X900X120-32N = smd 1.473 x 0.508: 1 -4.242,2.794; 2 -4.242,2.007; 3 -4.242,1.194; 4 -4.242,0.406; 5 -4.242,-0.406; 6 -4.242,-1.194; 7 -4.242,-2.007; 8 -4.242,-2.794; 17 4.242,-2.794; 18 4.242,-2.007; 19 4.242,-1.194; 20 4.242,-0.406; 21 4.242,0.406; 22 4.242,1.194; 23 4.242,2.007; 24 4.242,2.794 | smd 0.508 x 1.473: 9 -2.794,-4.242; 10 -2.007,-4.242; 11 -1.194,-4.242; 12 -0.406,-4.242; 13 0.406,-4.242; 14 1.194,-4.242; 15 2.007,-4.242; 16 2.794,-4.242; 25 2.794,4.242; 26 2.007,4.242; 27 1.194,4.242; 28 0.406,4.242; 29 -0.406,4.242; 30 -1.194,4.242; 31 -2.007,4.242; 32 -2.794,4.242
DG129-5.0-02P = drill 1.6: P$1 -2.54,0; P$2 2.54,0
RESONATOR-SMD-3.2X1.3 = smd 0.45 x 1.905: 1 -1.2,0; 2 0,0; 3 1.2,0

### Placement (x,y rotation side)
C1  81.41,48.13 0 top
C2  42.67,54.74 90 top
C3  78.74,93.73 0 bottom
C4  73.41,49.66 270 top
C5  90.17,59.69 0 top
C6  46.74,90.55 90 bottom
C7  79.76,76.83 0 bottom
C8  63.25,54.74 90 bottom
C10  92.46,27.3 270 bottom
C11  75.44,92.84 90 bottom
C100  46.86,23.62 180 bottom
C101  21.46,24 180 bottom
C102  74.68,23.37 180 bottom
C103  10.16,85.09 0 top
C104  25.53,84.84 0 bottom
D1  92.46,51.31 0 top
D2  11.43,77.47 90 top
D3  11.43,68.58 90 top
D100  10.16,88.27 180 top
D101  25.53,88.14 180 bottom
D102  17.91,88.39 180 top
D103  18.29,88.27 180 bottom
FUSE1  83.06,65.15 90 top
IC2  81.03,56.01 0 top
IC4  95.5,27.18 180 bottom
IC100  44.7,30.35 90 bottom
IC101  19.3,30.35 90 bottom
IC102  72.52,29.84 90 bottom
J1  7.49,7.37 0 top
J2  16.38,7.37 0 top
J3  25.27,7.37 0 top
J4  34.16,7.37 0 top
J5  43.05,7.37 0 top
J6  51.94,7.37 0 top
J7  60.83,7.37 0 top
J8  69.72,7.37 0 top
J9  78.74,7.37 0 top
J10  87.76,7.37 0 top
J11  5.08,78.74 270 top
J12  5.08,69.85 270 top
J18  60.83,93.34 0 top
J19  50.16,95.63 180 top
J20  12.95,95.63 180 top
J21  20.57,95.63 180 top
J22  31.62,95.63 180 top
J23  42.67,95.63 180 top
J24  95.25,76.2 270 top
L1  73.28,92.84 90 bottom
LED1  75.18,42.04 270 top
LED2  82.68,42.16 90 top
Q1  3.81,17.78 180 top
Q2  8.89,17.78 180 top
Q3  13.97,17.78 180 top
Q4  19.05,17.78 180 top
Q5  24.13,17.78 180 top
Q6  29.21,17.78 180 top
Q7  34.29,17.78 180 top
Q8  39.37,17.78 180 top
Q9  44.45,17.78 180 top
Q10  49.53,17.78 180 top
Q11  54.61,17.78 180 top
Q12  59.69,17.78 180 top
Q13  64.77,17.78 180 top
Q14  69.85,17.78 180 top
Q15  74.93,18.03 180 top
Q16  80.01,17.78 180 top
Q17  85.09,17.78 180 top
Q18  90.17,17.78 180 top
Q19  95.25,17.78 180 top
Q20  17.78,78.74 90 top
Q21  17.78,73.66 90 top
Q22  88.9,78.87 90 top
Q23  88.9,82.55 90 top
Q100  37.08,84.58 180 bottom
Q101  29.97,83.44 180 bottom
R1  3.68,22.61 0 top
R2  8.76,22.61 180 top
R3  13.84,22.61 180 top
R4  18.92,22.61 180 top
R5  24,22.61 180 top
R6  29.08,22.61 180 top
R7  34.16,22.61 180 top
R8  39.24,22.61 180 top
R9  44.32,22.61 180 top
R10  49.4,22.61 0 top
R11  54.48,22.61 0 top
R12  59.44,22.73 0 top
R13  64.52,22.73 0 top
R14  69.72,22.73 0 top
R15  74.68,22.73 0 top
R16  79.76,22.73 0 top
R17  8.13,60.33 90 top
R18  10.54,61.34 90 top
R19  12.83,62.48 90 top
R20  15.24,63.75 90 top
R21  22.86,78.74 90 top
R22  22.86,73.66 90 top
R23  89.79,87.12 270 top
R24  94.74,87.12 90 top
R25  93.85,79.76 180 top
R26  85.85,77.85 90 top
R27  35.81,88.65 180 bottom
R28  17.65,64.9 90 top
R29  19.94,66.17 90 top
R31  22.23,67.44 90 top
R32  24.77,68.71 90 top
R34  43.18,51.18 180 top
R35  69.6,91.44 0 bottom
R36  41.78,88.65 180 bottom
R37  61.59,65.41 0 top
R38  76.33,37.97 270 top
R39  81.66,37.97 270 top
R40  60.96,60.96 270 bottom
R41  64.77,62.23 270 bottom
R42  68.58,63.88 270 bottom
R43  93.85,83.31 180 top
R44  87.5,87.12 270 top
R46  55.88,91.57 180 top
R58  84.96,22.73 0 top
R59  90.04,22.73 180 top
R60  95.12,22.73 180 top
R75  62.23,50.8 180 top
R101  49.66,39.5 90 top
R102  34.8,39.5 90 top
R103  39.75,39.5 90 top
R104  52.58,39.5 90 top
R105  37.21,39.5 90 top
R106  55.24,39.5 90 top
R107  60.83,39.5 90 top
R108  57.91,39.5 90 top
R109  13.84,83.19 90 top
R110  21.97,83.95 90 bottom
R111  36.2,80.64 0 bottom
R112  31.88,80.64 180 bottom
R113  18.41,84.84 0 bottom
R114  17.91,85.34 0 top
R115  21.84,88.65 90 bottom
R116  13.84,87.38 90 top
R117  42.16,85.09 0 bottom
R118  29.84,87.76 0 bottom
S2  84.84,93.6 0 top
U1  34.04,56.01 180 top
U2  77.47,85.09 90 bottom
U3  54.61,55.88 180 top
U$1  92.71,43.18 270 top
Y1  75.56,76.2 0 bottom

### Tracks (layer width: path | path; a pad name or v marks a point on that pad's centre or on a via)
3V3
  Top 0.305: 94.87,79.25 94.87,79.69 R25.1 | R23.2 89.85,86.23
  Top 0.406: 94.8,81.66 R43.1 94.8,86.11 R24.1 R23.2 | 94.8,81.66 R25.1 | Q23.1 94.74,81.6 94.8,81.66 | Q22.1 93.85,77.92 94.87,78.93 94.87,79.69
+3V33  (via drill 0.4)
  Top 0.406: v28.96,90.04 v38.73,90.04
  Bottom 0.406: Q101.1 29.02,87.63 R118.2 28.96,87.82 v28.96,90.04 | 38.73,88.65 R27.2 36.13,88.02 Q100.1 | 38.73,88.65 R36.1 41.21,88.27 R117.2 | v38.73,90.04 38.73,88.65
+5V  (via drill 0.35, 0.4)
  Top 0.305: v39.62,50.42 38.35,50.42 36.96,51.81 U1.26 | U3.26 57.53,50.92 v58.67,49.78 | R37.2 64.9,65.41 v65.53,64.77 | 15.24,98.48 15.24,92.31 D102.C
  Top 0.406: R114.2 18.86,87 | 18.86,87 18.86,88.09 D102.C | v18.29,87 18.86,87 | v71.25,93.73 68.58,96.39 68.58,98.48 | R32.2 22.73,69.66 22.23,69.15 R31.2 20.19,68.39 19.94,68.13 R29.2 18.03,67.12 17.65,66.74 R28.2 15.62,65.85 15.24,65.47 R20.2 13.34,64.7 12.83,64.2 R19.2 10.92,63.43 10.54,63.05 R18.2 8.38,62.29 8.13,62.04 R17.2 5.15,61.27 5.08,61.34 | 43.88,38.55 R103.1 R105.1 R102.1 34.73,38.48 v20.95,38.48 5.08,54.36 5.08,61.34 | 43.88,38.55 R101.1 R104.1 R106.1 | R106.1 55.37,38.67 | R106.1 R108.1 R107.1 70.17,38.55 73.28,35.43 v73.28,30.48 | J12.2 5.08,61.34 | v43.94,38.48 v43.94,38.49 43.88,38.55 | R44.1 R23.1 89.79,89.53 94.11,93.85 | R26.1 80.58,76.9 v78.74,75.06 | 59.03,52.7 U3.28 | LED1.A 67.56,48.61 v67.56,52.7
  Top 0.61: U1.28 38.46,52.85 38.61,52.7 | C2.1 42.41,53.47 | 59.31,52.7 59.03,52.7
  Top 0.813: D2.C 11.25,75.24 | J12.2 11.25,66.35 D3.C | v78.74,75.06 v78.74,73.79 78.74,66.55 | FUSE1.2 78.74,66.55 | 78.74,66.55 75.69,66.55 v70.61,61.47 v67.56,58.55 v67.56,53.85 v67.56,52.7 | v61.21,52.7 v60.33,52.7 59.31,52.7 | v47.88,52.7 v46.99,52.7 42.67,52.7 | 42.67,52.7 v39.62,52.7 38.61,52.7 | C2.1 42.67,52.7
  Top 1.016: 42.67,98.48 48.08,98.48 50.16,96.39 J19.1 60.58,95.63 J18.P$2 63.42,98.48 68.58,98.48 89.48,98.48 94.11,93.85 98.48,89.48 98.48,70.16 96.9,68.58 J24.4 93.22,66.55 87.25,66.55 | J22.1 31.62,98.48 | J23.1 42.67,98.48 | 31.62,98.48 15.24,98.48 8.89,98.48 6.22,95.81 6.22,86.23 2.54,82.55 2.54,74.93 | 2.54,74.93 2.54,67.31 3.5,66.35 J12.2 | 2.54,74.93 2.85,75.24 J11.2 11.25,75.24 | FUSE1.2 87.25,66.55 | C5.+ 87.02,66.32 87.25,66.55 | 31.62,98.48 42.67,98.48
  Bottom 0.305: v39.62,50.42 v39.62,52.7 | 63.25,53.23 63.25,53.34 C8.1 | v58.67,49.78 59.44,49.78 60.33,50.67 v60.33,52.7 | IC4.5 94.83,26.3 C10.2 | C100.2 47.78,23.71 IC100.14 | C102.2 75.68,26.04 IC102.14 | IC101.14 22.46,26.46 C101.2 | R41.2 67.5,58.55 v67.56,58.55 | R40.2 60.96,52.7 | v65.53,64.77 67.37,62.93 R42.2 69.15,62.93 v70.61,61.47
  Bottom 0.406: R113.2 17.46,87 | 17.46,87 17.46,87.84 D103.C | v18.29,87 17.46,87 | R27.1 35.43,89.22 | R27.1 34.86,86.93 33.02,85.09 33.02,80.84 R112.2 R111.2 | C7.2 77.88,77.77 U2.4 77.88,82.55 76.28,82.55 U2.6 | R27.1 34.86,92.39 J22.1 | R35.1 70.55,93.03 v71.25,93.73 73.27,93.73 L1.2 | v20.95,38.48 19.68,37.21 19.68,28.07 21.21,26.54 IC101.14 | v43.94,38.48 43.94,28.32 45.72,26.54 IC100.14 | v73.28,30.48 73.28,26.8 74.04,26.04 75.68,26.04 | C10.2 92.19,26.04 IC102.14
  Bottom 0.61: v61.21,52.7 60.96,52.7
  Bottom 0.813: C7.2 78.81,75.12 v78.74,75.06 v78.74,73.79 | v67.56,53.85 v67.56,52.7 63.5,52.7 | 63.5,52.7 v61.21,52.7 v60.33,52.7 v47.88,52.7 v46.99,52.7 | 63.5,52.7 63.25,52.96 63.25,53.34
BLANK  (via drill 0.4)
  Top 0.305: U1.2 37.61,59.96 40.89,63.25 48.26,63.25 58.19,73.17 58.19,65.41 | U3.2 58.19,65.41 | R37.1 58.19,65.41
  Top 0.406: 58.19,73.17 67.56,82.55 73.41,82.55 v75.56,84.71
  Bottom 0.406: v75.56,84.71 74.37,85.9 74.37,85.92 74.01,86.28 U2.14
GND  (via drill 0.35, 0.4)
  Top 0.305: 12.89,19.1 Q3.2 | 17.97,19.1 Q4.2 | 33.21,19.1 Q7.2 | 38.29,19.1 Q8.2 | 43.37,19.1 Q9.2 | 48.45,19.1 Q10.2 | 53.53,19.1 Q11.2 | 58.61,19.1 Q12.2 | 63.69,19.1 Q13.2 | 68.77,19.1 Q14.2 | 73.85,19.36 Q15.2 | 78.93,19.1 Q16.2 | 84.14,19.23 Q17.2 | 89.22,19.23 Q18.2 | 94.3,19.23 Q19.2 | 53.34,57.15 53.34,55.88 54.86,55.88 55.59,55.88 U3.6 | U3.1 59.01,57.15 57.15,57.15 | U1.6 35.01,57.15 35.56,57.15 | U1.1 38.43,57.15
  Top 0.406: C103.1 8.91,85.34 D100.A 8.91,95.09 J20.2 | R22.2 22.71,74.76 Q21.2 | 92.9,37.02 R39.2 R38.2 | R2.2 7.81,24.58 v8.51,25.27 | U3.1 61.49,59.03 v62.74,57.78 | 38.43,57.15 38.05,56.77 v37.34,56.77 | U1.EXP 35.01,56.98 35.01,57.15
  Top 0.61: 32,56.01 v31.24,56.77 | 32,56.01 v31.24,55.24 | U1.EXP 32,56.01 | U1.EXP v33.27,55.24 | U1.EXP v34.29,56.01 | U1.EXP 34.54,56.01 v35.31,55.24 | 36.58,56.01 v36.32,56.01 U1.EXP | 36.58,56.01 v37.34,55.24 | U1.EXP v33.27,56.77 | U1.EXP 34.8,56.77 v35.31,56.77 | 36.58,56.01 v37.34,56.77 | U1.EXP 42.4,56.01 C2.2 42.81,55.88 v50.93,55.88 | 52.7,55.88 v51.94,56.64 | 52.7,55.88 v51.94,55.12 | U3.EXP 52.7,55.88 | v53.98,55.12 53.98,55.24 U3.EXP | U3.EXP 54.86,55.88 | U3.EXP 55.24,55.88 v56.01,55.12 55.37,55.12 U3.EXP | U3.EXP v57.02,55.88 | 57.28,55.88 v58.04,55.12 | U3.EXP 57.28,55.88 | 57.28,55.88 v58.04,56.64 | U3.EXP 54.61,56.01 v53.98,56.64 53.98,56.52 U3.EXP | U3.EXP 55.37,56.64 v56.01,56.64 | R34.1 v46.99,51.18
  Top 0.813: R21.2 22.71,79.84 Q20.2
  Top 1.27: 93.4,59.61 C5.- 93.19,59.56 | C1.1 78.75,49.79 IC2.1 | Q1.2 2.71,22.58 R1.1 | Q2.2 7.79,22.58 R2.2 | Q3.2 12.87,22.58 R3.2 | Q4.2 17.95,22.58 R4.2 | Q5.2 23.03,22.58 R5.2 | Q6.2 28.11,22.58 R6.2 | Q7.2 33.19,22.58 R7.2 | Q8.2 38.27,22.58 R8.2 | Q9.2 43.35,22.58 R9.2 | Q10.2 48.43,22.58 R10.1 | Q11.2 53.51,22.58 R11.1 | Q12.2 58.59,22.63 R12.1 | Q13.2 63.67,22.63 R13.1 | Q14.2 68.75,22.71 R14.1 | Q15.2 73.83,22.63 R15.1 | Q16.2 78.91,22.63 R16.1 | Q17.2 83.99,22.71 R58.1 | Q18.2 89.07,22.71 R59.2 | Q19.2 94.15,22.71 R60.2
  Bottom 0.406: C104.1 26.78,85.09 D101.A 26.78,90.06 24.62,92.22 J22.3 | U2.21 77.88,83.82 78.66,83.03 U2.3 78.66,79.38 79.43,78.61 80.26,78.61 80.71,78.17 C7.1 | U2.5 77.06,78.99 76.96,78.99 v76.83,78.87 | J23.3 39.1,92.2 40.77,92.2 42.73,90.24 R36.2 | IC4.3 97.45,28.03 v97.79,27.69 | Y1.2 75.56,73.66 v73.91,72.01
  Bottom 0.61: 57.28,55.88 v58.04,55.12 v58.04,56.64 57.28,55.88 | 57.28,55.88 v57.02,55.88 56.77,55.88 | 56.77,55.88 v56.01,56.64 55.24,55.88 | 56.77,55.88 v56.01,55.12 55.24,55.88 | 55.24,55.88 v54.99,55.88 54.74,55.88 | 54.74,55.88 v53.98,56.64 53.21,55.88 v52.96,55.88 | 54.74,55.88 v53.98,55.12 53.72,55.12 v52.96,55.88 | 52.7,55.88 v51.94,56.64 51.18,55.88 | v52.96,55.88 52.7,55.88 | 52.7,55.88 v51.94,55.12 51.18,55.88 | 51.18,55.88 v50.93,55.88 | v37.34,56.77 37.08,56.77 v36.32,56.01 | v37.34,55.24 36.58,56.01 v36.32,56.01 | 36.07,56.01 v35.31,56.77 34.54,56.01 | v36.32,56.01 36.07,56.01 | 36.07,56.01 v35.31,55.24 34.54,56.01 | 34.54,56.01 v34.29,56.01 | v34.29,56.01 U1.EXP v33.27,56.77 32.51,56.01 | v34.29,56.01 33.53,55.24 v33.27,55.24 32.51,56.01 | 32.51,56.01 v32.26,56.01 32,56.01 | 32,56.01 v31.24,56.77 30.48,56.01 | 32,56.01 v31.24,55.24 30.48,56.01 | 30.48,56.01 v30.23,56.01
  other vias: 79.63,85.85 77.98,85.85 89.66,93.47 91.19,93.47 93.6,90.81 85.34,73.28 87.88,73.28 85.34,70.74 87.88,70.74 71.37,72.01 71.37,69.47 73.91,69.47 61.21,73.28 63.75,73.28 63.75,70.74 61.21,70.74 34.54,74.55 38.35,74.55 34.54,70.74 38.35,70.74 52.32,88.52 49.78,88.52 37.08,92.33 26.92,92.33 26.92,80.9 7.87,82.17 10.41,92.33 19.3,92.33 52.32,79.63 14.22,51.69 16.76,51.69 16.76,49.15 14.22,49.15 10.41,40.26 12.95,40.26 10.41,37.72 12.95,37.72 68.2,42.42 66.55,46.99 70.74,41.15 72.9,39.12 65.02,34.29 67.56,34.29 87.12,48.51 88.39,48.51 88.39,47.5 87.12,47.5 90.68,34.67 90.68,32.13 97.79,30.23 96.52,8.64 19.18,2.16 34.42,2.16 48.39,2.16 59.82,2.16 71.25,2.16 83.95,2.16 57.4,29.21 39.62,35.56 32,27.94 52.32,25.4 16.76,24.13 85.6,35.94 85.6,33.4 77.98,44.83 70.36,56.26 90.68,54.99 93.22,54.99 77.72,64.39 76.45,63.12 81.03,51.05 60.71,26.04 67.44,20.95 72.52,20.95 77.6,20.95 82.68,20.95 87.76,20.95 94.11,20.95 62.36,20.95 57.28,20.95 52.2,20.95 47.12,20.95 42.04,20.95 42.04,24.77 36.96,20.95 36.96,24.77 31.88,20.95 26.8,20.95 28.07,26.04 21.72,20.95 16.64,20.95 24.64,26.29 11.56,20.95 12.57,24.89 6.48,20.95 2.67,20.95 47.12,57.15 42.04,58.42 42.04,59.69 40.77,59.69 40.77,58.42 47.12,58.42 47.12,59.69 47.12,60.96 82.04,93.85 83.69,93.85 76.83,95.63 92.84,20.95 89.03,20.95 83.95,20.95 78.87,20.95 73.79,20.95 68.71,20.95 63.63,20.95 58.55,20.95 53.47,20.95 43.31,20.95 38.23,20.95 33.15,20.95 28.07,20.95 22.99,20.95 17.91,20.95 12.83,20.95 7.75,20.95 1.4,20.95 65.28,46.99 64.01,46.99 62.74,46.99
  pour Bottom (isolate 0.61): 0,99.06 0,0 100.33,0 100.33,100.33 0,100.33
  pour Top (isolate 1.016): 0,100.33 0,0 100.33,0 100.33,100.33
GSCLK  (via drill 0.4)
  Top 0.305: U1.25 36.31,50.05 36.83,49.53 56.88,49.53 U3.25
  Top 0.406: v80.01,82.55 76.2,82.55 66.55,72.9 66.55,49.4 65.79,48.64 57.77,48.64 56.88,49.53
  Bottom 0.406: U2.1 80.26,82.3 v80.01,82.55
H_RXD  (via drill 0.5)
  Top 0.406: Q23.3 86.63,83.82 | 86.63,83.82 v85.6,83.82 | R44.2 87.5,84.69 86.63,83.82
  Bottom 0.406: U2.30 85.52,83.9 v85.6,83.82
H_TXD  (via drill 0.5)
  Top 0.305: 87.71,78.67 Q22.3 87.83,78.8 R26.2 85.89,78.83 86.05,78.99
  Top 0.406: v85.6,82.3 85.89,82.01 85.89,78.83
  Bottom 0.406: U2.31 84.81,83.08 v85.6,82.3
L_RXD  (via drill 0.5)
  Top 0.406: R43.2 v91.31,83.31 90.09,83.31 Q23.2
  Bottom 0.406: J24.2 90.17,78.74 90.17,82.17 v91.31,83.31
L_TXD  (via drill 0.5)
  Top 0.305: 92.65,80.01 R25.2 92.78,79.88 v91.31,79.88 89.97,79.88 Q22.2
  Bottom 0.406: J24.1 95,76.2 v91.31,79.88
LIGHT_SENSOR  (via drill 0.4)
  Top 0.406: R46.2 78.87,91.57 v79.5,90.93
  Bottom 0.406: J19.2 46.74,95.56 C6.2 54.54,91.5 R46.2 | U2.23 79.48,90.91 v79.5,90.93
MISO
  Bottom 0.406: J18.P$1 60.83,91.19 64.14,87.88 U2.16
MOSI_SIN  (via drill 0.4)
  Top 0.305: v62.61,87.12 42.8,67.31 38.1,67.31 35.66,64.87 U1.5
  Bottom 0.406: U2.15 62.64,87.1 v62.61,87.12 57.53,92.2 57.53,96.52 58.8,97.79 61.47,97.79 J18.P$4
N$1  (via drill 0.35)
  Top 0.305: R32.1 29.02,67.76 | U1.7 34.36,62.79 29.4,67.76 29.02,67.76 | v28.96,67.69 29.02,67.76
  Bottom 0.305: v28.96,67.69 15.62,67.69 3.81,55.88 3.81,32.38 9.65,26.54 IC101.1
N$2  (via drill 0.35)
  Top 0.305: 22.79,66.49 R31.1 26.99,66.49 | 26.99,66.49 29.27,66.49 33.71,62.05 U1.8 | v27.05,66.55 26.99,66.49
  Bottom 0.305: v27.05,66.55 16,66.55 5.21,55.75 5.21,35.69 11.81,29.08 IC101.3
N$3  (via drill 0.35)
  Top 0.305: 19.94,64.77 R29.1 24.89,65.22 | 24.89,65.22 29.52,65.22 33.06,61.68 U1.9 | v24.89,65.28 24.89,65.22
  Bottom 0.305: v24.89,65.28 16.76,65.28 6.59,55.1 6.59,36.34 11.3,31.62 IC101.5
N$4  (via drill 0.35)
  Top 0.305: 17.65,63.88 R28.1 24.26,63.95 | 24.26,63.95 29.78,63.95 32.41,61.31 U1.10 | v24.26,63.88 24.26,63.95
  Bottom 0.305: v24.26,63.88 24.26,42.42 28.83,37.85 28.83,34.16 27.56,32.89 IC101.9
N$5  (via drill 0.35)
  Top 0.305: R20.1 25.21,62.8 | 25.21,62.8 29.78,62.8 31.76,60.82 U1.11 | v25.15,62.74 25.21,62.8
  Bottom 0.305: v25.15,62.74 25.15,43.69 29.84,38.99 29.84,33.15 27.05,30.35 IC101.11
N$6  (via drill 0.35)
  Top 0.305: 13.02,61.34 R19.1 26.23,61.53 | 26.23,61.53 29.91,61.53 31.11,60.33 U1.12 | v26.16,61.47 26.23,61.53
  Bottom 0.305: IC101.13 23.37,27.81 23.75,27.81 27.94,27.81 31.24,31.11 31.24,39.37 26.16,44.45 v26.16,61.47
N$7  (via drill 0.35)
  Top 0.305: R18.1 27.24,60.39 | 27.24,60.39 30.16,60.39 30.46,60.09 U1.13 | v27.3,60.33 27.24,60.39
  Bottom 0.305: v27.3,60.33 27.3,45.34 32.51,40.13 32.51,30.99 36.96,26.54 IC100.1
N$8  (via drill 0.35)
  Top 0.305: U1.14 28.3,59.16 | 28.3,59.16 8.34,59.16 R17.1 | v28.32,59.18 28.3,59.16
  Bottom 0.305: v28.32,59.18 28.32,45.72 33.4,40.64 33.4,34.04 38.35,29.08 IC100.3
N$9  (via drill 0.35)
  Top 0.305: U1.22 34.36,49.2 35.81,47.75 56.45,47.75 58.86,45.34 | R107.2 60.83,43.37 58.86,45.34 | v58.8,45.34 58.86,45.34
  Bottom 0.305: v58.8,45.34 69.72,45.34 80.14,34.92 80.14,33.27 79.25,32.38 IC102.9
N$10  (via drill 0.35)
  Top 0.305: R1.2 4.73,22.51 | Q1.1 4.91,19.79 4.73,19.97 4.73,22.38 4.73,22.51 | R1.2 4.95,22.93 | 4.7,22.67 R1.2 | v10.16,27.81 8.89,27.81 4.73,23.65 4.73,22.51
  Bottom 0.305: IC101.2 v10.16,27.81
N$11  (via drill 0.35)
  Top 0.305: U1.20 33.06,48.73 35.56,46.23 52.58,46.23 v54.36,44.45 55.24,43.56 R106.2
  Bottom 0.305: v54.36,44.45 60.07,38.73 60.07,32.77 64.26,28.57 IC102.3
N$12  (via drill 0.35)
  Top 0.305: U1.19 32.41,48.49 35.31,45.59 49.02,45.59 v51.31,43.31 52.58,42.04 R104.2
  Bottom 0.305: v51.31,43.31 57.53,37.08 57.53,31.5 62.99,26.04 IC102.1
N$13  (via drill 0.35)
  Top 0.305: U1.18 31.76,48.25 35.05,44.96 45.85,44.96 v48.77,42.04 49.66,41.15 R101.2
  Bottom 0.305: v48.77,42.04 54.61,36.2 54.61,29.21 53.21,27.81 IC100.13
N$14  (via drill 0.35)
  Top 0.305: U1.17 31.11,47.88 36.07,42.93 v37.59,42.93 39.75,40.77 R103.2
  Bottom 0.305: v37.59,42.93 44.96,42.93 52.96,34.92 52.96,31.24 52.2,30.48 47.9,30.48 IC100.11
N$15  (via drill 0.35)
  Top 0.305: U1.16 30.46,47.64 v36.07,42.04 37.21,40.89 R105.2
  Bottom 0.305: v36.07,42.04 38.1,40.01 44.45,40.01 45.47,38.99 45.47,33.78 46.35,32.89 IC100.9
N$16  (via drill 0.35)
  Top 0.305: U1.15 29.64,47.19 v34.67,42.16 34.8,42.04 R102.2
  Bottom 0.305: v34.67,42.16 34.67,36.2 39.24,31.62 IC100.5
N$17  (via drill 0.35)
  Top 0.305: U1.21 33.71,48.97 35.69,46.99 54.1,46.99 v56.52,44.58 57.91,43.18 R108.2
  Bottom 0.305: v56.52,44.58 62.1,38.99 62.1,34.67 65.66,31.11 IC102.5
N$18
  Top 1.27: Q8.3 39.37,9.07 J4.2
N$19  (via drill 0.35)
  Top 0.305: R3.1 14.79,19.81 | 14.79,19.81 14.79,19.36 Q3.1 | v14.22,32.89 14.22,22.35 14.86,21.72 14.86,19.88 14.79,19.81
  Bottom 0.305: IC101.6 v14.22,32.89
N$20
  Top 1.27: Q4.3 19.88,15.65 J2.2
N$21  (via drill 0.35)
  Top 0.305: Q8.1 40.19,19.36 R8.1 40.13,22.61 40.13,29.59 v39.37,30.35
  Bottom 0.305: IC100.4 v39.37,30.35
N$22
  Top 1.27: Q3.3 16.38,14.07 J2.1
N$23  (via drill 0.35)
  Top 0.305: v24.38,34.16 24.38,28.57 19.87,24.06 R4.1 20.15,22.33 Q4.1
  Bottom 0.305: IC101.8 v24.38,34.16
N$24  (via drill 0.35)
  Top 0.305: Q16.1 80.71,19.48 R16.2 80.71,23.94 78.36,26.29 v78.36,33.66
  Bottom 0.305: IC102.8 v78.36,33.66
N$25
  Top 1.27: J8.2 80.01,14.15 Q16.3
N$26
  Top 1.27: J1.1 3.81,11.05 Q1.3
N$27  (via drill 0.35)
  Top 0.305: Q5.1 25.23,22.33 R5.1 24.95,24.06 26.54,25.65 v26.54,31.62
  Bottom 0.305: v26.54,31.62 IC101.10
N$28
  Top 1.27: Q5.3 25.27,15.34 J3.1
N$29
  Top 1.27: Q18.3 90.17,15.3 J9.2
N$30  (via drill 0.35)
  Top 0.305: Q6.1 30.03,19.36 R6.1 30.03,26.74 v27.69,29.08
  Bottom 0.305: IC101.12 v27.69,29.08
N$31
  Top 1.27: Q10.3 46.55,13.5 J5.2
N$32
  Top 1.27: Q6.3 29.21,7.8 J3.2
N$33  (via drill 0.35)
  Top 0.305: Q15.1 75.63,19.74 R15.2 75.63,24.7 72.14,28.19 v72.14,28.96
  Bottom 0.305: IC102.6 70.71,32.38 72.14,30.96 v72.14,28.96
N$34
  Top 1.27: Q2.3 10.99,14.38 J1.2
N$35
  Top 1.27: Q11.3 54.61,13.97 51.94,11.3 J6.1
N$36  (via drill 0.35)
  Top 0.305: Q14.1 70.67,19.36 R14.2 70.48,22.92 70.48,23.62 65.02,29.08 v65.02,29.84
  Bottom 0.305: IC102.4 v65.02,29.84
N$37
  Top 1.27: J7.2 64.33,8.89 69.85,14.41 Q14.3
N$38  (via drill 0.35)
  Top 0.305: 50.35,19.36 Q10.1 50.63,22.33 R10.2 50.29,22.67 v50.29,32.89
  Bottom 0.305: IC100.8 49.53,34.16 50.29,33.4 v50.29,32.89
N$39  (via drill 0.35)
  Top 0.305: Q13.1 65.47,19.48 R13.2 65.47,24.32 63.5,26.29 v63.5,27.3
  Bottom 0.305: IC102.2 v63.5,27.3
N$40  (via drill 0.35)
  Top 0.305: Q9.1 45.27,19.36 R9.1 45.27,26.48 39.75,32 v39.75,32.89
  Bottom 0.305: IC100.6 v39.75,32.89
N$41
  Top 1.27: J7.1 60.83,10.16 64.77,14.1 Q13.3
N$42
  Top 0.406: J20.1 13.84,94.74 R116.2
N$43  (via drill 0.35)
  Top 0.305: Q12.1 60.39,19.48 R12.2 60.39,23.18 54.48,29.08 v53.09,29.08
  Bottom 0.305: IC100.12 v53.09,29.08
N$44
  Top 1.27: J6.2 55.44,10.16 59.69,14.41 Q12.3
N$45
  Top 1.27: J5.1 43.05,15.08 Q9.3
N$46  (via drill 0.35)
  Top 0.305: Q11.1 55.43,19.36 R11.2 55.43,24.2 51.82,27.81 v51.82,31.62
  Bottom 0.305: IC100.10 47.9,31.75 51.82,31.75 v51.82,31.62
N$47
  Top 1.27: J8.1 69.72,8.89 74.93,14.1 Q15.3
N$48
  Bottom 0.406: J21.1 21.84,94.36 R115.2
N$51
  Top 1.27: 83.41,51.21 IC2.3 | C1.2 83.31,49.03 IC2.3 | D1.C 90.31,51.21 IC2.3
N$53
  Bottom 0.305: 76.77,77.4 Y1.1
  Bottom 0.406: 76.77,77.4 75.46,78.7 U2.7
N$54
  Bottom 0.305: Y1.3 74.36,77.47 74.36,77.54
  Bottom 0.406: U2.8 74.36,80.54 74.36,77.47
N$55
  Top 0.305: U1.27 37.61,51.92 38.35,51.18 R34.2
N$56
  Top 0.406: 76.45,39.05 R38.1 76.33,41.94 LED1.C
N$57
  Bottom 0.406: D103.A 21.27,88.27 R115.1 | D101.C 23.84,87.7 R115.1 | R115.1 21.97,87.57 R110.2
N$58
  Top 0.406: R39.1 81.63,38.98 LED2.C
N$59
  Top 0.406: D100.C 11.41,87.63 12.61,86.43 R116.1 | D102.A 14.69,86.43 R116.1 | R116.1 R109.2
N$60  (via drill 0.35)
  Top 0.305: v54.74,64.39 54.28,63.94 U3.8
  Bottom 0.305: v54.74,64.39 54.8,64.45 63.5,64.45 R41.1 65.85,63.18 72.39,56.64 72.39,52.58 88.52,36.45 88.52,30.35 85.47,27.3 IC102.13
N$61
  Top 0.813: J11.1 10.65,78.74 D2.A 12.21,78.74 Q20.3
N$62  (via drill 0.35)
  Top 0.305: v54.23,65.79 53.63,65.19 U3.9
  Bottom 0.305: v54.23,65.79 67.82,65.79 68.58,65.02 R42.1 70.55,64.83 74.42,60.96 74.42,55.5 95.5,34.42 IC4.2
N$63
  Bottom 0.406: J22.2 30.8,92.96 R118.1 30.92,87.63 Q101.2
N$64
  Bottom 0.406: Q100.2 40.56,83.06 42.42,83.06 43.11,83.75 R117.1 44.45,85.09 44.45,90.35 J23.2
N$65
  Bottom 0.406: L1.1 73.33,91.89 C11.1 75.44,89.36 U2.18
N$66
  Top 1.27: FUSE1.1 83.06,60.42 IC2.4 78.99,58.39 C4.+
N$67
  Bottom 0.406: C3.2 77.06,93 U2.20
N$68  (via drill 0.35)
  Top 0.305: v55.24,62.99 54.94,62.99 U3.7
  Bottom 0.305: v55.24,62.99 60.33,62.99 60.96,62.36 R40.1 61.66,61.91 69.6,53.98 69.6,49.78 82.55,36.83 82.55,32.26 80.14,29.84 IC102.11
N$70  (via drill 0.35)
  Top 0.305: Q2.1 9.71,19.36 R2.1 9.71,24.19 12.06,26.54 v12.06,30.35
  Bottom 0.305: IC101.4 v12.06,30.35
N$71  (via drill 0.35)
  Top 0.305: Q7.1 35.11,19.36 R7.1 35.11,25.71 v37.21,27.81
  Bottom 0.305: IC100.2 v37.21,27.81
N$72
  Top 0.305: LED2.A 87.28,45.72 U$1.P$1
  Top 0.406: 95.16,46.9 95.25,46.99
  Top 1.27: 95.25,46.99 95.25,51.31 D1.A | U$1.P$1 93.98,45.72 95.16,46.9
N$73
  Top 1.27: Q7.3 34.29,7.49 J4.1
N$74
  Top 0.813: J12.1 10.65,69.85 D3.A 14.46,73.66 Q21.3
N$75  (via drill 0.35)
  Top 0.305: Q19.1 96.07,19.36 R60.1 96.07,25.08 v96.14,25.15
  Bottom 0.305: v96.14,25.15 96.15,25.16 IC4.4
N$84
  Top 0.305: U3.27 58.19,51.44 58.82,50.8 R75.2
N$85  (via drill 0.35)
  Top 0.305: Q17.1 85.91,19.36 R58.2 85.91,24.83 v79.63,31.11
  Bottom 0.305: IC102.10 v79.63,31.11
N$86  (via drill 0.35)
  Top 0.305: Q18.1 90.99,19.36 R59.1 90.93,22.79 90.93,24.38 86.74,28.57 v84.71,28.57
  Bottom 0.305: IC102.12 v84.71,28.57
N$88
  Top 1.27: Q19.3 95.25,14.86 J10.1
N$116
  Top 1.27: J9.1 85.09,13.72 Q17.3
RELAY0  (via drill 0.4)
  Top 0.406: Q20.1 22.71,77.64 R21.1 22.96,77.89 49.11,77.89 49.06,77.85 v49.02,77.85 | v82.3,89.15 68.83,89.15 v59.69,80.01
  Bottom 0.406: v82.3,89.15 82.3,88.47 U2.25 | v59.69,80.01 57.53,77.85 v49.02,77.85
RELAY1  (via drill 0.4)
  Top 0.406: Q21.1 19.23,72.71 R22.1 25.21,72.71 v25.27,72.77 | v83.95,88.14 69.47,88.14 v61.47,80.14
  Bottom 0.406: U2.26 82.91,87.1 v83.95,88.14 | v61.47,80.14 54.1,72.77 v25.27,72.77
RESET  (via drill 0.4)
  Top 0.406: v85.85,86.74 85.85,89.28 83.44,91.69 S2.3
  Bottom 0.406: U2.29 83.8,84.68 v85.85,86.74 85.85,95.5 84.2,97.16 69.72,97.16 J18.P$5 67.82,91.44 R35.2
SCLK  (via drill 0.4)
  Top 0.305: U3.4 56.88,68.08 v56.26,68.71 | v45.85,68.71 43.05,65.91 38.99,65.91 36.31,63.23 U1.4
  Top 0.406: v65.15,89.28 65.15,88.01 v45.85,68.71
  Bottom 0.406: J18.P$3 63.37,90.55 64.59,89.33 64.77,89.33 | 64.77,89.33 U2.17 | v65.15,89.28 64.82,89.28 64.77,89.33 | v56.26,68.71 v45.85,68.71
SENSOR_BOTTOM
  Bottom 0.406: Q100.3 37.15,83.52 R111.1 43.18,80.64 47.22,84.68 68.86,84.68 68.88,84.66 69.55,84.66 69.58,84.68 U2.12
SENSOR_TOP
  Bottom 0.406: Q101.3 30.93,81.48 R112.1 30.93,79.94 32,78.87 43.05,78.87 48.08,83.9 U2.11
SOUT  (via drill 0.4)
  Top 0.305: v42.67,48.64 36.32,48.64 35.66,49.3 U1.24 | v55.63,67.56 56.23,66.95 U3.5
  Bottom 0.406: v42.67,48.64 45.09,51.05 45.09,62.1 50.55,67.56 v55.63,67.56
SWITCH_BOTTOM
  Bottom 0.406: R110.1 24.13,83 24.53,83.39 C104.2 | R110.1 20.32,83 19.36,83.95 R113.1 | R110.1 26.99,77.98 43.81,77.98 48.92,83.08 U2.10
SWITCH_TOP  (via drill 0.4)
  Top 0.406: C103.2 11.16,82.82 v11.43,82.55 11.74,82.23 R109.1 14.93,82.23 16.96,84.27 R114.1
  Bottom 0.406: v11.43,82.55 17.14,76.83 44.32,76.83 49.78,82.3 U2.9
XLAT  (via drill 0.4)
  Top 0.305: U1.3 36.96,61.47 40.13,64.64 43.56,64.64 v48.9,69.98 | U3.3 57.53,69.34 v56.9,69.98
  Top 0.406: v69.22,85.98 61.98,78.74 57.66,78.74 v48.9,69.98
  Bottom 0.406: U2.13 71.48,85.5 70.74,86.23 69.47,86.23 v69.22,85.98 | v56.9,69.98 v48.9,69.98

### Text on the board
tNames: RESET | RELAY0 | TOP / SWITCH | BOTTOM / SWITCH | TOP SENSOR / GND | IN | +5V | BOTTOM SENSOR / GND | IN | +5V | LIGHT / SENSOR | 5V | MOSI | GND / MISO | SCLK | RST | TX | +5V | RX | GND | +5V | RELAY1 | +5V | +12V | LED STAIRS / CONTROLLER V4 | +5V | +12V | GND | -1 | -2 | -3 | -4 | -5 | -6 | -7 | -8 | -9 | -10 | -11 | -12 | -13 | -14 | -15 | -16 | -17 | -18 | -19